# EAGLE design HV Board rev14 (EAGLE 9.6.2)
ENGINEER: Arvind Srinivasan

## Sheet 1 of 3: GLV Systems 1 (Main I/O, Power, Current Sensors, and Shutdown Circuit)
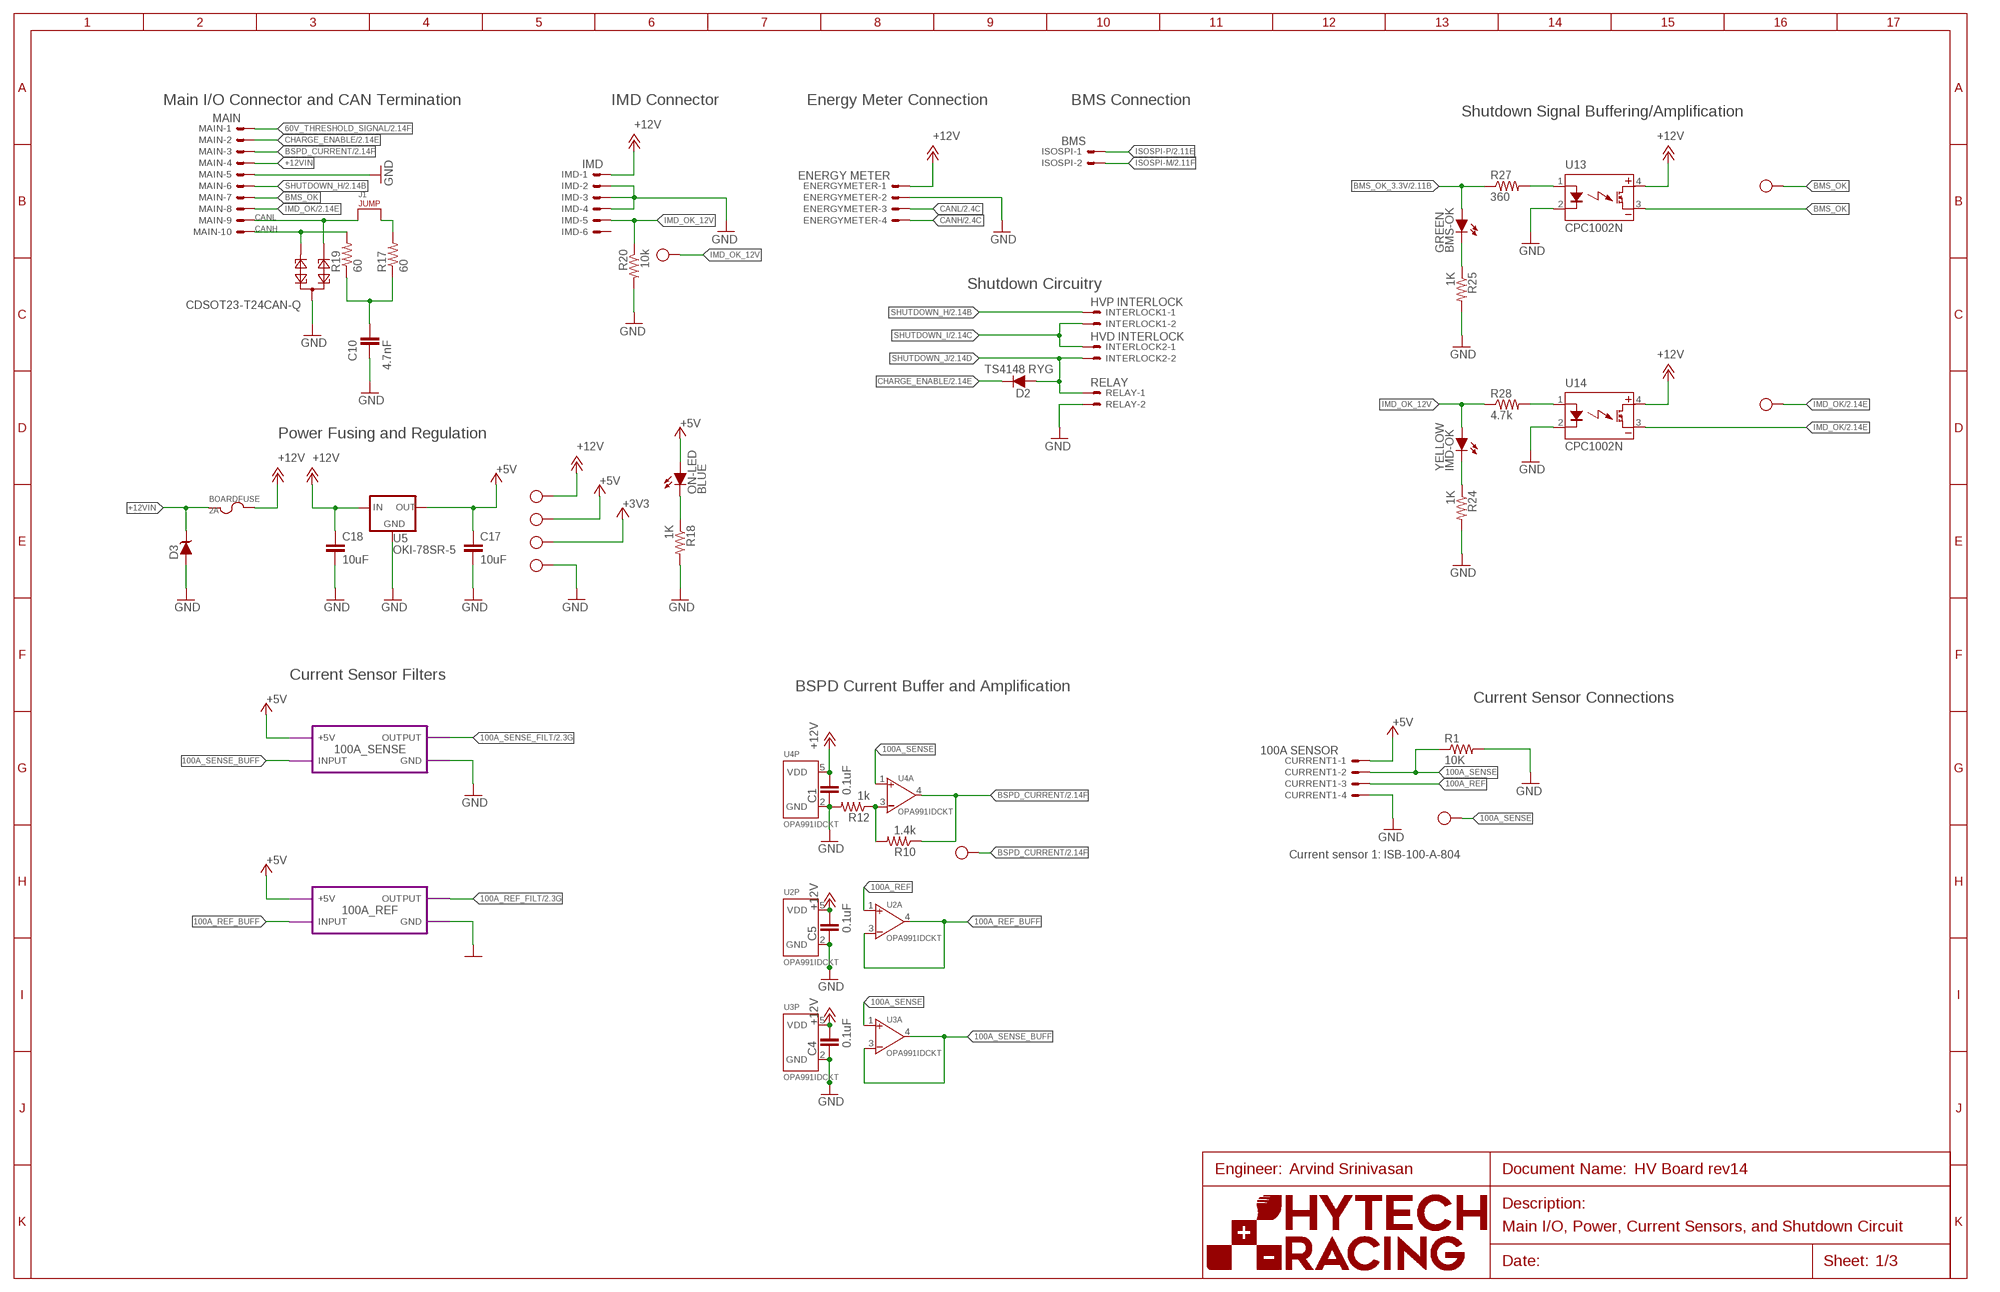
[diagram p0: schematic, sheet 1]
U$1 (FRAME_B): FRAME_DESCRIPTION: Main I/O, Power, Current Sensors, and Shutdown Circuit; ORIENTATION: LANDSCAPE; SIZE: B

### Parts
$$U$3  TEST_POINTMICRO_MINIATURE  [MICRO_MINIATURE]
$$U$12  TEST_POINTMICRO_MINIATURE  [MICRO_MINIATURE]
BMS-OK  GREEN  LED-0603  [LED-603]
BOARDFUSE  2A  FUSE_MINIBLADE  [MINI-BLADE_FUSE_HOLDER]
C1  0.1uF  CAP0603-CAP  [0603-CAP@1]
C4  0.1uF  CAP0603-CAP  [0603-CAP@1]
C5  0.1uF  CAP0603-CAP  [0603-CAP@1]
C10  4.7nF  CAP0603-CAP  [0603-CAP@1]
C17  10uF  CAP0603-CAP  [0603-CAP@1]
C18  10uF  CAP0603-CAP  [0603-CAP@1]
CURRENT1  100A SENSOR  CONNECTOR-4NANO-FIT-VERTICAL-4  [NANO-FIT_VERTICAL-4]
D2  TS4148 RYG  DIODE0805  [0805_D]
D3  TVS_15V  [SOT-23]
ENERGYMETER  ENERGY METER  CONNECTOR-4NANO-FIT-VERTICAL-4  [NANO-FIT_VERTICAL-4]
IMD  IMD  CONNECTOR-6NANO-FIT_VERTICAL-6  [NANO-FIT_VERTICAL-6]
IMD-OK  YELLOW  LED-0603  [LED-603]
INTERLOCK1  HVP INTERLOCK  CONNECTOR-2NANO-FIT_VERTICAL-2  [NANO-FIT_VERTICAL-2]
INTERLOCK2  HVD INTERLOCK  CONNECTOR-2NANO-FIT_VERTICAL-2  [NANO-FIT_VERTICAL-2]
ISOSPI  BMS  CONNECTOR-2NANO-FIT_VERTICAL-2  [NANO-FIT_VERTICAL-2]
J1  JUMPER.1  [1X02]
MAIN  MAIN  CONNECTOR-10NANO-FIT_VERTICAL-10  [NANO-FIT_VERTICAL-10]
ON-LED  BLUE  LED-0603  [LED-603]
R1  10K  RESISTOR0603  [0603-RES@1]
R10  1.4k  RESISTOR0603  [0603-RES@1]
R12  1k  RESISTOR0603  [0603-RES@1]
R17  60  RESISTOR0603  [0603-RES@1]
R18  1K  RESISTOR0603  [0603-RES@1]
R19  60  RESISTOR0603  [0603-RES@1]
R20  10k  RESISTOR0603  [0603-RES@1]
R24  1K  RESISTOR0603  [0603-RES@1]
R25  1K  RESISTOR0603  [0603-RES@1]
R27  360  RESISTOR0603  [0603-RES@1]
R28  4.7k  RESISTOR0603  [0603-RES@1]
RELAY  RELAY  CONNECTOR-2NANO-FIT_VERTICAL-2  [NANO-FIT_VERTICAL-2]
U2  OPAMP_1_CHANNEL_OPA991  [SC-70-5]
U3  OPAMP_1_CHANNEL_OPA991  [SC-70-5]
U4  OPAMP_1_CHANNEL_OPA991  [SC-70-5]
U5  OKI-78SR-5  [OKI-78SR@1]
U10  CDSOT23-T24CAN-Q  [SOT23]
U13  CPC1002N  [SOP04]
U14  CPC1002N  [SOP04]
U$3  TEST_POINTMICRO_MINIATURE  [MICRO_MINIATURE]
U$4  TEST_POINTMICRO_MINIATURE  [MICRO_MINIATURE]
U$5  TEST_POINTMICRO_MINIATURE  [MICRO_MINIATURE]
U$6  TEST_POINTMICRO_MINIATURE  [MICRO_MINIATURE]
U$7  TEST_POINTMICRO_MINIATURE  [MICRO_MINIATURE]
U$11  TEST_POINTMICRO_MINIATURE  [MICRO_MINIATURE]
U$13  TEST_POINTMICRO_MINIATURE  [MICRO_MINIATURE]

### Module instances
100A_SENSE = 1KHZ-FILTER
100A_REF = 1KHZ-FILTER

### Nets
60V_THRESHOLD_SIGNAL: MAIN.P$1 ; also sheet 2,3
100A_REF: CURRENT1.P$3 U2.1(A:VIN+)
100A_REF_BUFF: U2.3(A:VIN-) U2.4(A:VOUT) ; port 100A_REF.INPUT
100A_REF_FILT: port 100A_REF.OUTPUT ; also sheet 2
100A_SENSE: CURRENT1.P$2 R1.1 U3.1(A:VIN+) U4.1(A:VIN+) U$4.P$1
100A_SENSE_BUFF: U3.3(A:VIN-) U3.4(A:VOUT) ; port 100A_SENSE.INPUT
100A_SENSE_FILT: port 100A_SENSE.OUTPUT ; also sheet 2
+3V3: U$7.P$1 ; also sheet 2
+5V: $$U$3.P$1 C17.1 CURRENT1.P$1 ON-LED.A U5.3(OUT) ; port 100A_SENSE.+5V 100A_REF.+5V ; also sheet 2
+12V: BOARDFUSE.R1 BOARDFUSE.R2 C1.2 C4.2 C5.2 C18.1 ENERGYMETER.P$1 IMD.P$1 U2.5(P:VDD) U3.5(P:VDD) U4.5(P:VDD) U5.1(IN) U13.4(DC+) U14.4(DC+) U$5.P$1 ; also sheet 2,3
+12VIN: BOARDFUSE.L1 BOARDFUSE.L2 D3.3(C) MAIN.P$4
BMS_OK: MAIN.P$7 U13.3(DC-) U$13.P$1
BMS_OK_3.3V: BMS-OK.A R27.1 ; also sheet 2
BSPD_CURRENT: MAIN.P$3 R10.1 U4.4(A:VOUT) U$6.P$1 ; also sheet 2
CANH: ENERGYMETER.P$4 MAIN.P$10 R19.2 U10.2 ; also sheet 2
CANL: ENERGYMETER.P$3 J1.1 MAIN.P$9 U10.1 ; also sheet 2
CHARGE_ENABLE: D2.C MAIN.P$2 ; also sheet 2
GND: C1.1 C4.1 C5.1 C10.1 C17.2 C18.2 CURRENT1.P$4 D3.1(A) ENERGYMETER.P$2 IMD.P$2 IMD.P$3 IMD.P$4 MAIN.P$5 R1.2 R12.2 R18.2 R20.2 R24.2 R25.2 RELAY.P$2 U2.2(P:GND) U3.2(P:GND) U4.2(P:GND) U5.2(GND) U10.3 U13.2(CONTROL-) U14.2(CONTROL-) U$3.P$1 ; port 100A_SENSE.GND 100A_REF.GND ; also sheet 2,3
IMD_OK: $$U$12.P$1 MAIN.P$8 U14.3(DC-) ; also sheet 2
IMD_OK_12V: IMD-OK.A IMD.P$5 R20.1 R28.1 U$11.P$1
ISOSPI-M [ISO_SPI]: ISOSPI.P$2 ; also sheet 2
ISOSPI-P [ISO_SPI]: ISOSPI.P$1 ; also sheet 2
N$3: ON-LED.C R18.1
N$8: R28.2 U14.1(CONTROL+)
N$9: IMD-OK.C R24.1
N$11: C10.2 R17.1 R19.1
N$15: R10.2 R12.1 U4.3(A:VIN-)
N$16: R27.2 U13.1(CONTROL+)
N$17: BMS-OK.C R25.1
N$23: J1.2 R17.2
SHUTDOWN_H: INTERLOCK1.P$1 MAIN.P$6 ; also sheet 2
SHUTDOWN_I: INTERLOCK1.P$2 INTERLOCK2.P$1 ; also sheet 2
SHUTDOWN_J: D2.A INTERLOCK2.P$2 RELAY.P$1 ; also sheet 2,3
Unconnected: IMD.P$6

### Notes on the sheet
- Main I/O Connector and CAN Termination | IMD Connector | Energy Meter Connection | BMS Connection
- Shutdown Signal Buffering/Amplification
- Shutdown Circuitry
- Power Fusing and Regulation
- Current Sensor Filters
- BSPD Current Buffer and Amplification
- Current Sensor Connections
- Current sensor 1: ISB-100-A-804

## Sheet 2 of 3: GLV Systems 2 (Microcontroller, Watchdog, BMS, CAN, and ADC)
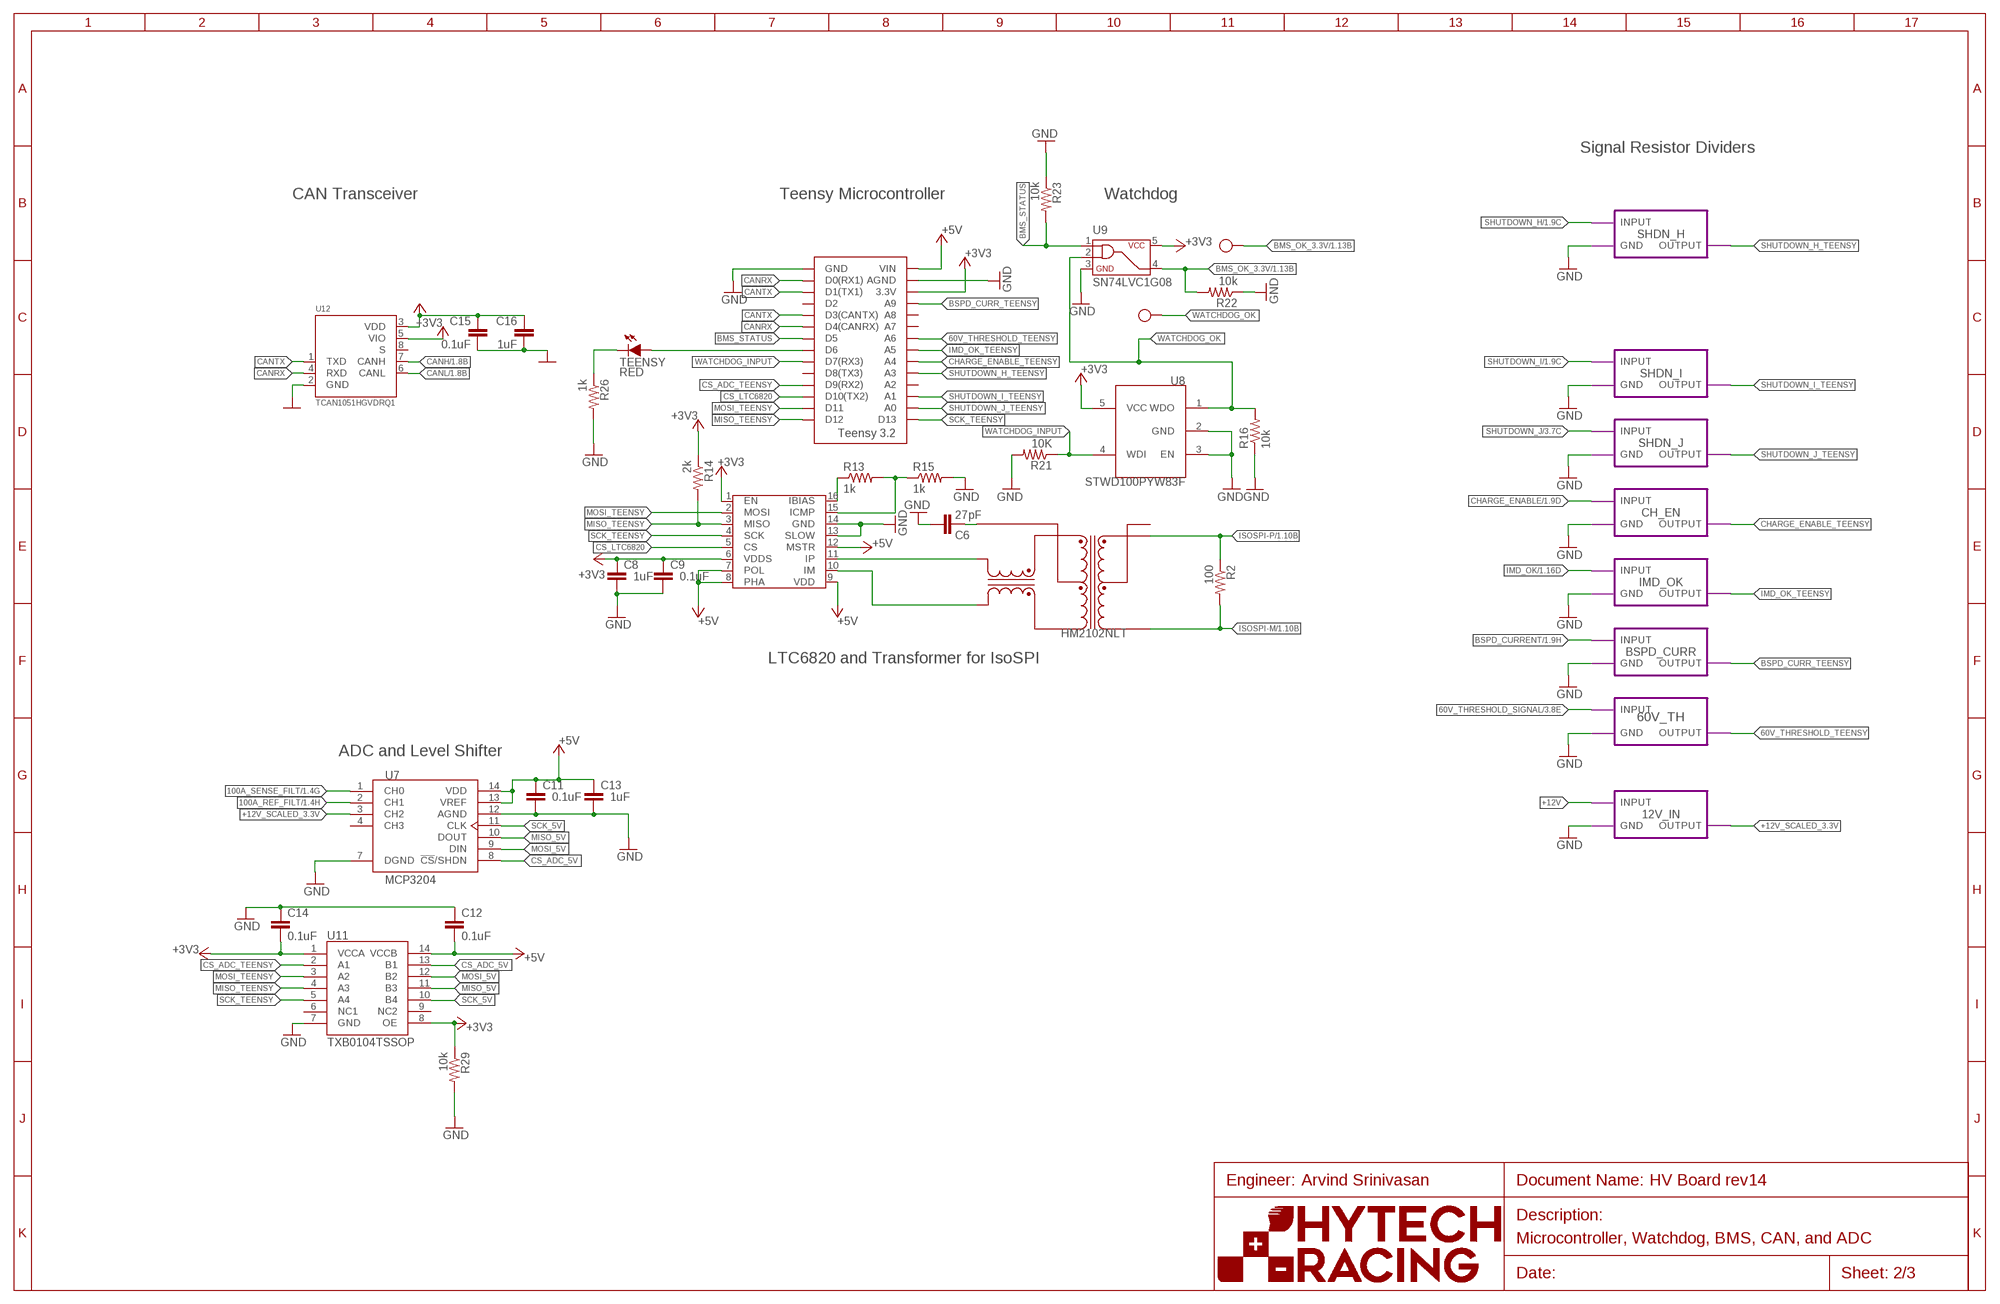
[diagram p1: schematic, sheet 2]
U$12 (FRAME_B): FRAME_DESCRIPTION: Microcontroller, Watchdog, BMS, CAN, and ADC; ORIENTATION: LANDSCAPE; SIZE: B

### Parts
C6  27pF  CAP0603-CAP  [0603-CAP@1]
C8  1uF  CAP0603-CAP  [0603-CAP@1]
C9  0.1uF  CAP0603-CAP  [0603-CAP@1]
C11  0.1uF  CAP0603-CAP  [0603-CAP@1]
C12  0.1uF  CAP0603-CAP  [0603-CAP@1]
C13  1uF  CAP0603-CAP  [0603-CAP@1]
C14  0.1uF  CAP0603-CAP  [0603-CAP@1]
C15  0.1uF  CAP0603-CAP  [0603-CAP@1]
C16  1uF  CAP0603-CAP  [0603-CAP@1]
R2  100  RESISTOR0603  [0603-RES@1]
R13  1k  RESISTOR0603  [0603-RES@1]
R14  2k  RESISTOR0603  [0603-RES@1]
R15  1k  RESISTOR0603  [0603-RES@1]
R16  10k  RESISTOR0603  [0603-RES@1]
R21  10K  RESISTOR0603  [0603-RES@1]
R22  10k  RESISTOR0603  [0603-RES@1]
R23  10k  RESISTOR0603  [0603-RES@1]
R26  1k  RESISTOR0603  [0603-RES@1]
R29  10k  RESISTOR0603  [0603-RES@1]
TEENSY  RED  LED-0603  [LED-603]
TEENSY3.1  TEENSY_3.2_SIMPLE  [TEENSY_3.2_SIMPLE]
U1  HM2102NLT  [HM2102NLT]
U6  LTC6820  [MSOP-16]
U7  MCP3204  [SO14]
U8  STWD100PYW83F  [SOT323-5]
U9  SN74LVC1G08  SN74LVC1G08SOT-323-5  [SOT323-5]
U11  TXB0104TSSOP  [TSSOP-14]
U12  CAN_TRANSCIEVER_TCAN1051HQV-Q1  [SOIC-08]
U$9  TEST_POINTMICRO_MINIATURE  [MICRO_MINIATURE]
U$10  TEST_POINTMICRO_MINIATURE  [MICRO_MINIATURE]

### Module instances
SHDN_J = 43/12-RESISTOR-DIVIDER
SHDN_H = 43/12-RESISTOR-DIVIDER
IMD_OK = 43/12-RESISTOR-DIVIDER
BSPD_CURR = 43/12-RESISTOR-DIVIDER
CH_EN = 43/12-RESISTOR-DIVIDER
SHDN_I = 43/12-RESISTOR-DIVIDER
12V_IN = 43/12-RESISTOR-DIVIDER
60V_TH = 43/12-RESISTOR-DIVIDER

### Nets
60V_THRESHOLD_SIGNAL: port 60V_TH.INPUT ; also sheet 1,3
60V_THRESHOLD_TEENSY: TEENSY3.1.A6 ; port 60V_TH.OUTPUT
100A_REF_FILT: U7.2(CH1) ; also sheet 1
100A_SENSE_FILT: U7.1(CH0) ; also sheet 1
+3V3: C8.1 C9.1 C14.1 R14.1 R29.1 TEENSY3.1.3.3V U6.1(EN) U6.6(VDDS) U8.5(VCC) U9.5 U11.1(VCCA) U11.8(OE) U12.5(VIO) ; also sheet 1
+5V: C11.1 C12.1 C13.1 C15.2 C16.2 TEENSY3.1.VIN U6.7(POL) U6.8(PHA) U6.9(VDD) U6.12(MSTR) U7.13(VREF) U7.14(VDD) U11.14(VCCB) U12.3(VDD) ; also sheet 1
+12V: port 12V_IN.INPUT ; also sheet 1,3
+12V_SCALED_3.3V: U7.3(CH2) ; port 12V_IN.OUTPUT
BMS_OK_3.3V: R22.2 U9.4 U$10.P$1 ; also sheet 1
BMS_STATUS: R23.2 TEENSY3.1.D5 U9.1
BSPD_CURR_TEENSY: TEENSY3.1.A9 ; port BSPD_CURR.OUTPUT
BSPD_CURRENT: port BSPD_CURR.INPUT ; also sheet 1
CANH: U12.7(CANH) ; also sheet 1
CANL: U12.6(CANL) ; also sheet 1
CANRX: TEENSY3.1.D0(RX1) TEENSY3.1.D4(CANRX) U12.4(RXD)
CANTX: TEENSY3.1.D1(TX1) TEENSY3.1.D3(CANTX) U12.1(TXD)
CHARGE_ENABLE: port CH_EN.INPUT ; also sheet 1
CHARGE_ENABLE_TEENSY: TEENSY3.1.A4 ; port CH_EN.OUTPUT
CS_ADC_5V: U7.8(!CS!/SHDN) U11.13(B1)
CS_ADC_TEENSY: TEENSY3.1.D9(RX2) U11.2(A1)
CS_LTC6820: TEENSY3.1.D10(TX2) U6.5(CS)
GND: C6.2 C8.2 C9.2 C11.2 C12.2 C13.2 C14.2 C15.1 C16.1 R15.2 R16.1 R21.2 R22.1 R23.1 R26.2 R29.2 TEENSY3.1.AGND TEENSY3.1.GND U6.13(SLOW) U6.14(GND) U7.7(DGND) U7.12(AGND) U8.2(GND) U8.3(EN) U9.3 U11.7(GND) U12.2(GND) ; port SHDN_H.GND SHDN_J.GND CH_EN.GND IMD_OK.GND BSPD_CURR.GND 60V_TH.GND SHDN_I.GND 12V_IN.GND ; also sheet 1,3
IM: U1.P$10(TD-) U6.10(IM)
IMD_OK: port IMD_OK.INPUT ; also sheet 1
IMD_OK_TEENSY: TEENSY3.1.A5 ; port IMD_OK.OUTPUT
IP: U1.P$12(TD+) U6.11(IP)
ISOSPI-M [ISO_SPI]: R2.2 U1.P$3(MX-) ; also sheet 1
ISOSPI-P [ISO_SPI]: R2.1 U1.P$1(MX+) ; also sheet 1
MISO_5V: U7.10(DOUT) U11.11(B3)
MISO_TEENSY: R14.2 TEENSY3.1.D12 U6.3(MISO) U11.4(A3)
MOSI_5V: U7.9(DIN) U11.12(B2)
MOSI_TEENSY: TEENSY3.1.D11 U6.2(MOSI) U11.3(A2)
N$29: R26.1 TEENSY.C
N$31: R13.1 U6.16(IBIAS)
N$32: R13.2 R15.1 U6.15(ICMP)
N$35: C6.1 U1.P$11(TCT)
SCK_5V: U7.11(CLK) U11.10(B4)
SCK_TEENSY: TEENSY3.1.D13 U6.4(SCK) U11.5(A4)
SHUTDOWN_H: port SHDN_H.INPUT ; also sheet 1
SHUTDOWN_H_TEENSY: TEENSY3.1.A3 ; port SHDN_H.OUTPUT
SHUTDOWN_I: port SHDN_I.INPUT ; also sheet 1
SHUTDOWN_I_TEENSY: TEENSY3.1.A1 ; port SHDN_I.OUTPUT
SHUTDOWN_J: port SHDN_J.INPUT ; also sheet 1,3
SHUTDOWN_J_TEENSY: TEENSY3.1.A0 ; port SHDN_J.OUTPUT
TEENSY_STATUS: TEENSY3.1.D6 TEENSY.A
WATCHDOG_INPUT: R21.1 TEENSY3.1.D7(RX3) U8.4(WDI)
WATCHDOG_OK: R16.2 U8.1(WDO) U9.2 U$9.P$1
Unconnected: TEENSY3.1.A2 TEENSY3.1.A7 TEENSY3.1.A8 TEENSY3.1.D2 TEENSY3.1.D8(TX3) U1.P$2(MCT) U1.P$4(MX+) U1.P$5(MCT) U1.P$6(MX-) U1.P$7(TD-) U1.P$8(TCT) U1.P$9(TD+) U7.4(CH3) U11.6(NC1) U11.9(NC2) U12.8(S)

### Notes on the sheet
- Signal Resistor Dividers
- CAN Transceiver | Teensy Microcontroller | Watchdog
- LTC6820 and Transformer for IsoSPI
- ADC and Level Shifter

## Sheet 3 of 3: HV Systems (Discharge, Precharge, and TSAL Signal/Voltage Indicator)
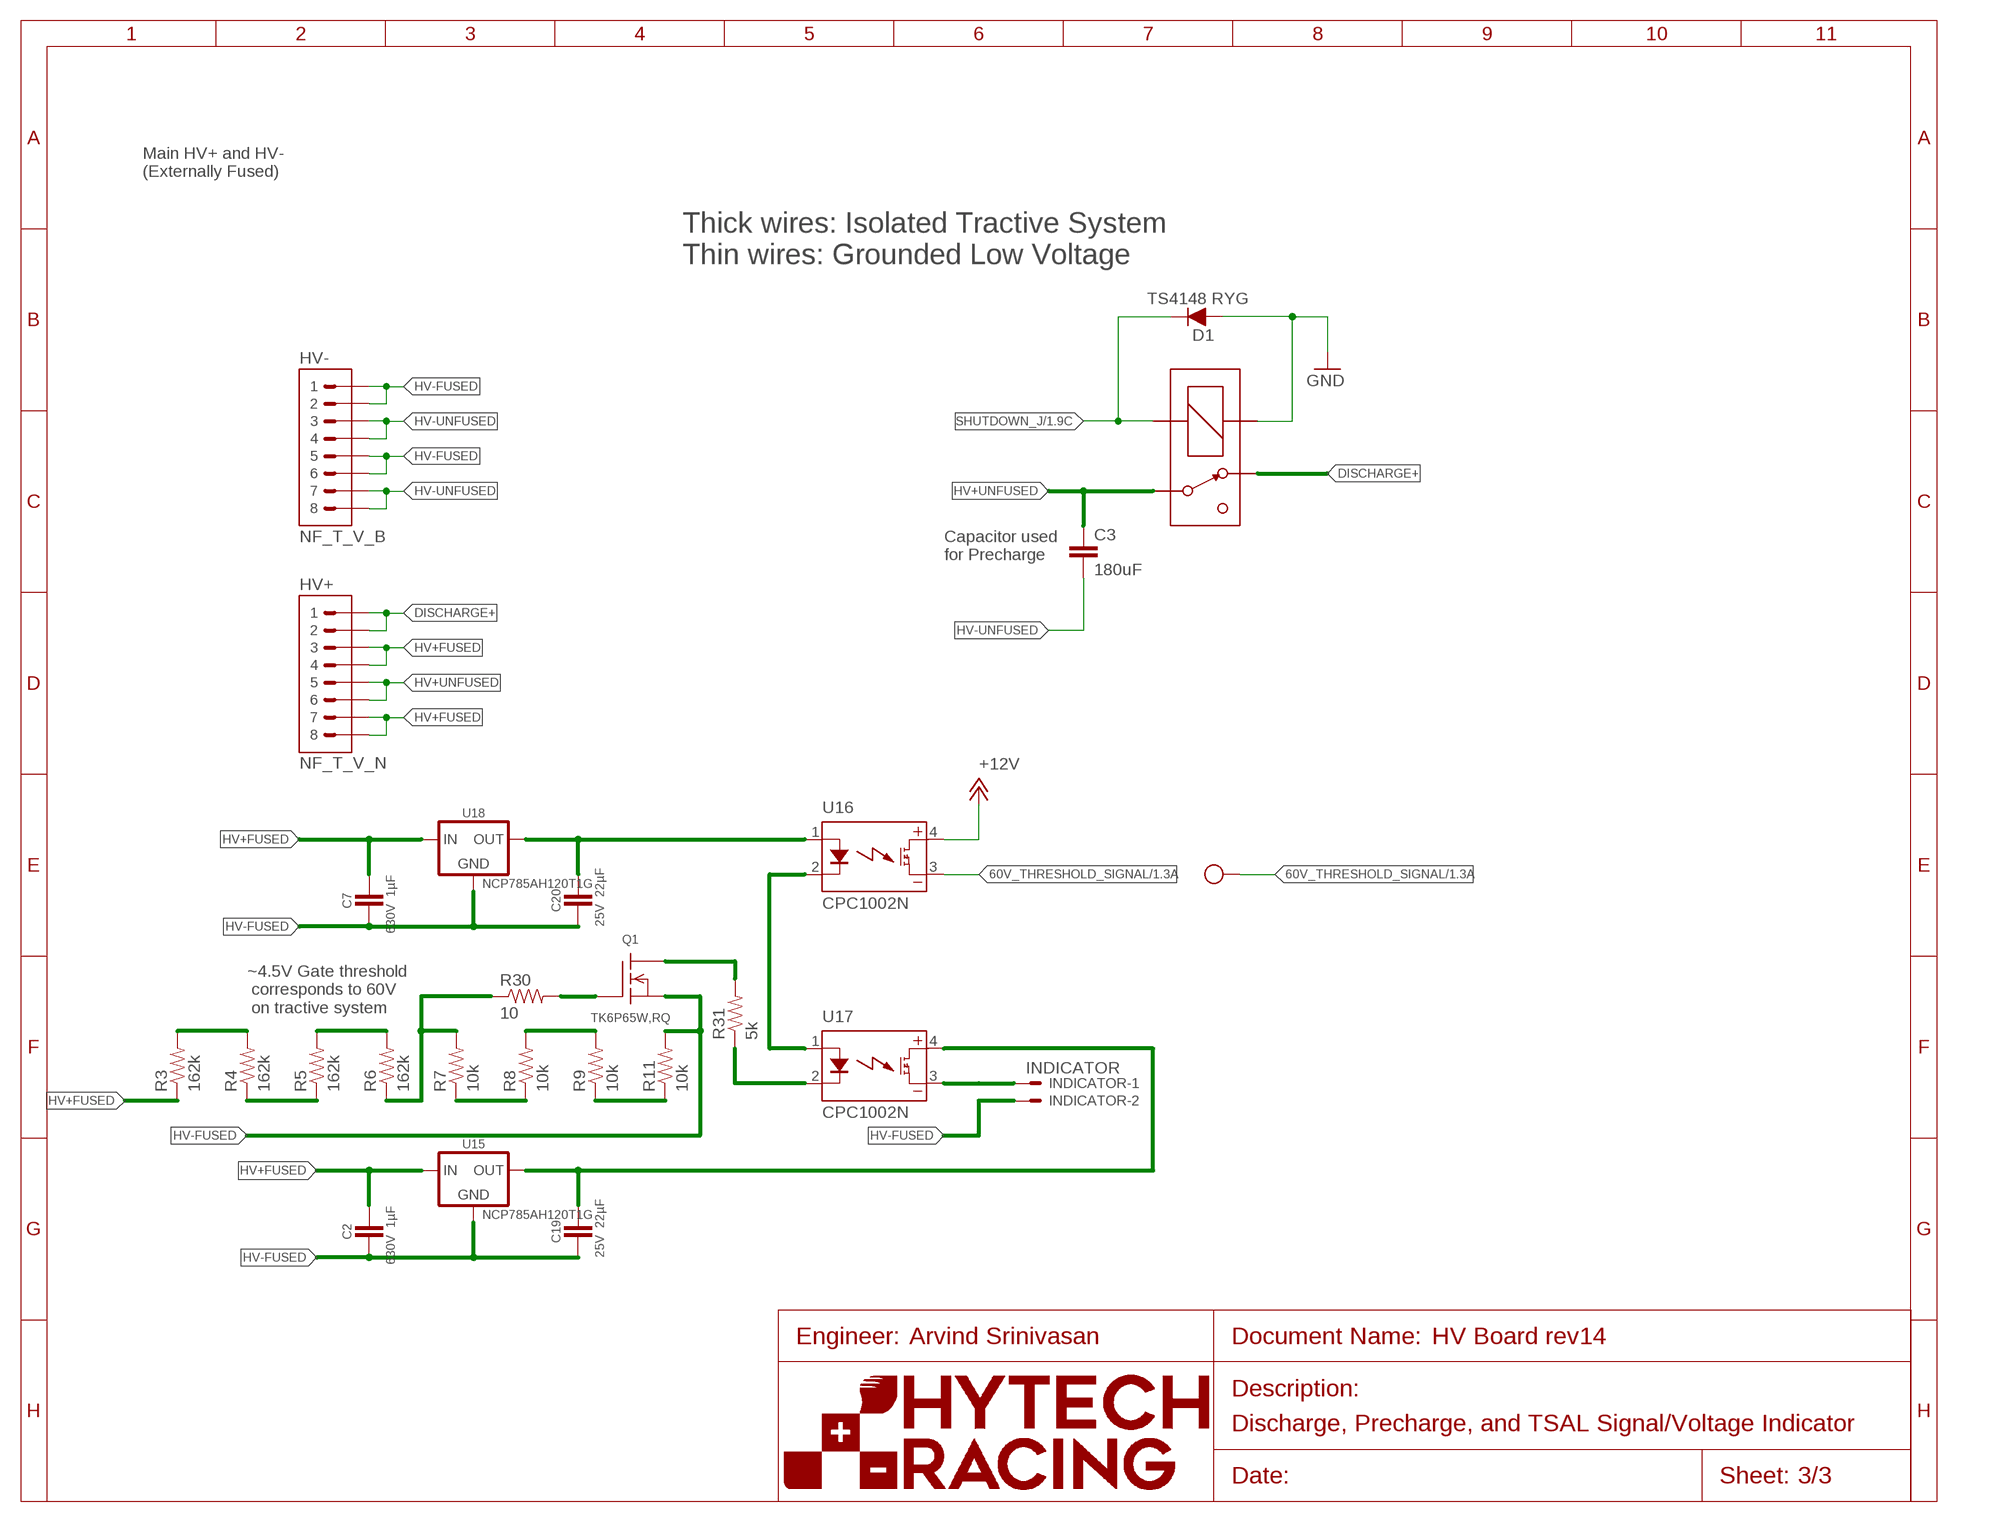
[diagram p2: schematic, sheet 3]
U$2 (FRAME_A): FRAME_DESCRIPTION: Discharge, Precharge, and TSAL Signal/Voltage Indicator; ORIENTATION: LANDSCAPE; SIZE: A

### Parts
$$$$U$3  DBT71210  [DBT71210]
C2  CAPACITOR_2220_630V_1UF  [2220-CAP]
C3  180uF  CAP  [LLS2V181MELA]
C7  CAPACITOR_2220_630V_1UF  [2220-CAP]
C19  CAPACITOR_0805_25V_22UF  [0805-CAP]
C20  CAPACITOR_0805_25V_22UF  [0805-CAP]
D1  TS4148 RYG  DIODE0805  [0805_D]
HV+  CONNECTOR-8_NF_T_V_NATURAL  [MOLEX_NANOFIT_PTH_08]
HV-  CONNECTOR-8_NF_T_V_BLACK  [MOLEX_NANOFIT_PTH_08]
INDICATOR  INDICATOR  CONNECTOR-2NANO-FIT_VERTICAL-2  [NANO-FIT_VERTICAL-2]
Q1  TRANSISTOR_N_MOS_2-7K1S_TK6P65W  [DPAK(2-7K1S)]
R3  162k  RESISTOR0603  [0603-RES@1]
R4  162k  RESISTOR0603  [0603-RES@1]
R5  162k  RESISTOR0603  [0603-RES@1]
R6  162k  RESISTOR0603  [0603-RES@1]
R7  10k  RESISTOR0603  [0603-RES@1]
R8  10k  RESISTOR0603  [0603-RES@1]
R9  10k  RESISTOR0603  [0603-RES@1]
R11  10k  RESISTOR0603  [0603-RES@1]
R30  10  RESISTOR0603  [0603-RES@1]
R31  5k  RESISTOR0603  [0603-RES@1]
U15  VOLTAGE_REGULATOR_SOT89_12V  [SOT89]
U16  CPC1002N  [SOP04]
U17  CPC1002N  [SOP04]
U18  VOLTAGE_REGULATOR_SOT89_12V  [SOT89]
U$8  TEST_POINTMICRO_MINIATURE  [MICRO_MINIATURE]

### Nets
60V_THRESHOLD_SIGNAL: U16.3(DC-) U$8.P$1 ; also sheet 1,2
+12V: U16.4(DC+) ; also sheet 1,2
DISCHARGE+ [TS]: $$$$U$3.CONTACT2(O) HV+.1 HV+.2
GND: $$$$U$3.COIL+ D1.A ; also sheet 1,2
HV+FUSED [TS]: C2.1 C7.1 HV+.3 HV+.4 HV+.7 HV+.8 R3.1 U15.1(IN) U18.1(IN)
HV+UNFUSED [TS]: $$$$U$3.CONTACT1(P) C3.P$1 HV+.5 HV+.6
HV-FUSED [TS]: C2.2 C7.2 C19.2 C20.2 HV-.1 HV-.2 HV-.5 HV-.6 INDICATOR.P$2 Q1.3(S) R11.2 U15.2(GND) U15.2@2(GND) U18.2(GND) U18.2@2(GND)
HV-UNFUSED: C3.P$2 HV-.3 HV-.4 HV-.7 HV-.8
N$4: Q1.1(G) R30.2
N$5 [TS]: C19.1 U15.3(OUT) U17.4(DC+)
N$7 [TS]: R9.1 R11.1
N$10 [TS]: R8.2 R9.2
N$12 [TS]: R7.1 R8.1
N$18 [TS]: C20.1 U16.1(CONTROL+) U18.3(OUT)
N$19 [TS]: R6.1 R7.2 R30.1
N$20 [TS]: R5.2 R6.2
N$21 [TS]: R4.1 R5.1
N$22 [TS]: R3.2 R4.2
N$30 [TS]: R31.1 U17.2(CONTROL-)
N$33 [TS]: U16.2(CONTROL-) U17.1(CONTROL+)
N$34 [TS]: INDICATOR.P$1 U17.3(DC-)
N$58 [TS]: Q1.2(D) R31.2
SHUTDOWN_J: $$$$U$3.COIL- D1.C ; also sheet 1,2

### Notes on the sheet
- Main HV+ and HV-
  (Externally Fused)
- Thick wires: Isolated Tractive System
  Thin wires: Grounded Low Voltage
- Capacitor used
  for Precharge
- ~4.5V Gate threshold
   corresponds to 60V
   on tractive system

## Library data of the parts
$$$$U$3 = HyTechDevices:DBT71210: DBT71210 Reed Relay Form B (Standard normally closed), switch 12V
$$U$3 $$U$12 U$3-U$11 U$13 = HyTechDevices:TEST_POINT: Keystone Electronics Test Point 5005
BMS-OK IMD-OK ON-LED TEENSY = HyTechDevices:LED: Light Emitting Diode (LED) Source: Dangerous Prototypes Eagle Library <https://github.com/DangerousPrototypes/Eagle_Part_Library>
BOARDFUSE = HyTechDevices:FUSE: Fuse/Fuseclips Keystone Electronics 3568 Fuse Mouser Part <http://www.mouser.com/ProductDetail/Keystone-Electronics/3568> Datasheet <http://www.mouser.com/ds/2/215/568-742601.pdf> Bussman/Eaton Midget Fuse Clip 1A3400 <http://www.mouser.com/ProductDetail/Bussmann-Eaton/BK-1A3400-09-R/?qs=sGAEpiMZZMuG%252bgnN5hGYGzzlAelq2OxnKqVSMVjq8I4%3d> Schurter 0751.0110 Brass Fuse Clip Datasheet <http://www.mouser.com/ds/2/358/typ_OG__Clip__5x20-2553.pdf> Bel Fuse 0ZCF Series Surface Mount PTC (resettable) Fuse Datasheet <https://belfuse.com/resources/CircuitProtection/datasheets/0ZCF%20Nov2016.pdf> Littelfuse 1812L Series Surface Mount PTC (resettable) Fuse Datasheet <https://m.littelfuse.com/~/media/electronics/datasheets/resettable_ptcs/littelfuse_ptc_1812l_datasheet.pdf.pdf>; RATING: 3A
C1 C4 C5 C10 = HyTechDevices:CAP: Capacitor Standard 0603 ceramic capacitor, and 0.1" leaded capacitor.; TOLERANCE: 5%; VOLTAGE: 50V
C2 C7 = HyTechDevices:CAPACITOR_?_*: Capacitor, Non-Polarized VJ...1BC Series Datasheet <https://www.mouser.com/datasheet/2/427/vjw1bcbascomseries-1762447.pdf> Samsung Datasheet <https://www.mouser.com/datasheet/2/585/MLCC-1837944.pdf> Walsin Datasheet <https://www.mouser.com/datasheet/2/210/WTC_MLCC_General_Purpose-1534899.pdf> GRM188R61A226ME15D <https://www.mouser.com/datasheet/2/281/1/GRM188R61A226ME15_02A-1985787.pdf> GRM188R61E106MA73D <https://www.mouser.com/datasheet/2/281/1/GRM188R61E106MA73_01A-1985806.pdf> 885012006013 <https://www.mouser.com/datasheet/2/445/885012006013-1726946.pdf> 2220Y6300105KXTWS2 <https://www.mouser.com/datasheet/2/218/SMD_High_and_Std_StackiCap_P62-1825512.pdf> Yageo Class 2, X5R <https://www.mouser.com/datasheet/2/447/UPY_GPHC_X5R_4V_to_50V_26-1827097.pdf>; CAPACITANCE: 1µF; DKPN: 1608-2220Y6300105KXTWS2CT-ND; MANUFACTURER: Knowles Syfer; MOPN: 843-2220Y63105KXTWS2; MPN: 2220Y6300105KXTWS2; TOLERANCE: 10%; VOLTAGE: 630V
C3 = HyTechDevices:CAP: Capacitor Standard 0603 ceramic capacitor, and 0.1" leaded capacitor.
C6 C8 C9 C11-C16 = HyTechDevices:CAP: Capacitor Standard 0603 ceramic capacitor, and 0.1" leaded capacitor.; TOLERANCE: 5%; VOLTAGE: 10V
C17 C18 = HyTechDevices:CAP: Capacitor Standard 0603 ceramic capacitor, and 0.1" leaded capacitor.; TOLERANCE: 5%; VOLTAGE: 25V
C19 C20 = HyTechDevices:CAPACITOR_?_*: Capacitor, Non-Polarized VJ...1BC Series Datasheet <https://www.mouser.com/datasheet/2/427/vjw1bcbascomseries-1762447.pdf> Samsung Datasheet <https://www.mouser.com/datasheet/2/585/MLCC-1837944.pdf> Walsin Datasheet <https://www.mouser.com/datasheet/2/210/WTC_MLCC_General_Purpose-1534899.pdf> GRM188R61A226ME15D <https://www.mouser.com/datasheet/2/281/1/GRM188R61A226ME15_02A-1985787.pdf> GRM188R61E106MA73D <https://www.mouser.com/datasheet/2/281/1/GRM188R61E106MA73_01A-1985806.pdf> 885012006013 <https://www.mouser.com/datasheet/2/445/885012006013-1726946.pdf> 2220Y6300105KXTWS2 <https://www.mouser.com/datasheet/2/218/SMD_High_and_Std_StackiCap_P62-1825512.pdf> Yageo Class 2, X5R <https://www.mouser.com/datasheet/2/447/UPY_GPHC_X5R_4V_to_50V_26-1827097.pdf>; CAPACITANCE: 22µF; DKPN: 311-1903-1-ND; MANUFACTURER: Yageo; MOPN: 603-CC805MKX5R8BB226; MPN: CC0805MKX5R8BB226; TOLERANCE: 20%; VOLTAGE: 25V
CURRENT1 ENERGYMETER = HyTechDevices:CONNECTOR-4: Mini-Fit Junior connector 4 pole Source: http://www.molex.com
D1 D2 = HyTechDevices:DIODE: DIODE general purpose rectifier
D3 = HyTechDevices:TVS_*: TVS Diode GSOT Datasheet <https://www.mouser.com/datasheet/2/427/gsot03-1767593.pdf>; DKPN: GSOT15-E3-08CT-ND; MANUFACTURER: Vishay General Semiconductor - Diodes Division; MOPN: 78-GSOT15-E3-08; MPN: GSOT15-E3-08; VOLTAGE: 15V
HV+ = HyTechDevices:CONNECTOR-8_?_*: 8 Pin Connector; MANUFACTURER: Molex; MODEL: NF_T_V_N; MPN: 105310-2308
HV- = HyTechDevices:CONNECTOR-8_?_*: 8 Pin Connector; MANUFACTURER: Molex; MODEL: NF_T_V_B; MPN: 105310-1308
IMD = HyTechDevices:CONNECTOR-6: Mini-Fit Junior connector 6 pole Source: http://www.molex.com
INDICATOR INTERLOCK1 INTERLOCK2 ISOSPI RELAY = HyTechDevices:CONNECTOR-2: Mini-Fit Junior connector 2 pole Source: http://www.molex.com
J1 = HyTechDevices:JUMPER: Jumper for changing operation of a device
MAIN = HyTechDevices:CONNECTOR-10: Mini-Fit Junior connector 10 pole Source: http://www.molex.com
Q1 = HyTechDevices:TRANSISTOR_N_MOS_?_*: N-MOSFET PMV15ENEA Datasheet <https://www.mouser.com/datasheet/2/916/PMV15ENEA-1604828.pdf> TK6P65W Datasheet <https://www.mouser.com/datasheet/2/408/TK6P65W_datasheet_en_20151225-1916290.pdf>; DKPN: TK6P65WRQCT-ND; MANUFACTURER: Toshiba Semiconductor and Storage; MOPN: 757-TK6P65WRQ; MPN: TK6P65W,RQ
R1 R10 R12-R15 R17-R21 R24-R29 = HyTechDevices:RESISTOR: Resistor Basic schematic elements and footprints for 0603, 1206, and PTH resistors.; TOLERANCE: 1%
R2 = HyTechDevices:RESISTOR: Resistor Basic schematic elements and footprints for 0603, 1206, and PTH resistors.; TOLERANCE: 1%; TYPE: TERMINATION
R3-R9 R11 R16 R22 R23 R30 R31 = HyTechDevices:RESISTOR: Resistor Basic schematic elements and footprints for 0603, 1206, and PTH resistors.
TEENSY3.1 = HyTechDevices:TEENSY_3.2_SIMPLE: Simple version of the Teensy 3.2 board that only uses the 2 main rows of pins, not the inner pins or the pins opposite the usb port.
U1 = HyTechDevices:HM2102NLT: 2 Channel SMT Transformer Turns ratio: 1CT: 1CT Isolation Voltage: 4300 VDC Inductance: 150 uH Leakage Inductance: 0.50 uH max DataSheet <https://www.mouser.com/datasheet/2/336/HM2102NL-1218600.pdf>
U2-U4 = HyTechDevices:OPAMP_1_CHANNEL_*: Op-Amp 1 Channel OPA991 Datasheet <https://www.ti.com/lit/ds/symlink/opa991.pdf?ts=1615503614502> Note: OPA991 is also a comparator; MPN: OPA991IDCKT
U5 = HyTechDevices:OKI-78SR-5: Murata OKI-78SR 5V 1.5A Non-Isolated Switching Regulator DC/DC - Datasheet <https://power.murata.com/data/power/oki-78sr.pdf>
U6 = HyTechDevices:LTC6820: Linear Technology isoSPI Isolated Communications Interface Datasheet <http://cds.linear.com/docs/en/datasheet/6820fb.pdf>
U7 = HyTechDevices:MCP3204
U8 = HyTechDevices:STWD100PYW83F: STWD100 Watchdog Timer (push-pull configuration) Datasheet <https://www.st.com/resource/en/datasheet/stwd100.pdf>
U9 = HyTechDevices:SN74LVC1G08: TI SN74LVC1G08 SINGLE 2-INPUT POSITIVE-AND GATE Datasheet <https://www.ti.com/lit/ds/symlink/sn74lvc1g08.pdf>
U10 = HyTechDevices:CDSOT23-T24CAN-Q: CAN Bus dual TVS array for transceiver ESD and surge protection
U11 = HyTechDevices:TXB0104: Texas Instruments TXB0104 4-channel low voltage to high voltage Logic Level Shifter. Minimum input voltage level 1.8V. Maximum output voltage level 5.5V.
U12 = HyTechDevices:CAN_TRANSCIEVER_TCAN1051*V-Q1: TCAN1051*V Can Tranciever Datasheet <https://www.ti.com/lit/ds/symlink/tcan1051hgv-q1.pdf?HQS=dis-mous-null-mousermode-dsf-pf-null-wwe&ts=1610765132518&ref_url=https%253A%252F%252Fwww.mouser.com%252Ff>; DKPN: 296-49935-1-ND; MANUFACTURER: Texas Instruments; MOPN: 595-TCAN1051HGVDQ1; MPN: TCAN1051HGVDRQ1
U13 U14 U16 U17 = HyTechDevices:CPC1002N: IXYS Solid State Relay .7A
U15 U18 = HyTechDevices:VOLTAGE_REGULATOR_?_*: Voltage Regulators LDL1117S50R Datasheet <https://www.mouser.com/datasheet/2/389/dm00366442-1799212.pdf> OKI-78SR Datasheet <https://www.mouser.com/datasheet/2/281/oki-78sr-56393.pdf> NCP785AH120T1G <https://www.mouser.com/datasheet/2/308/NCP785A_D-1812704.pdf>; DKPN: NCP785AH120T1GOSCT-ND; MANUFACTURER: ON Semiconductor; MOPN: 863-NCP785AH120T1G; MPN: NCP785AH120T1G

## Module 43/12-RESISTOR-DIVIDER
Ports: INPUT(in) GND(pwr) OUTPUT(out)
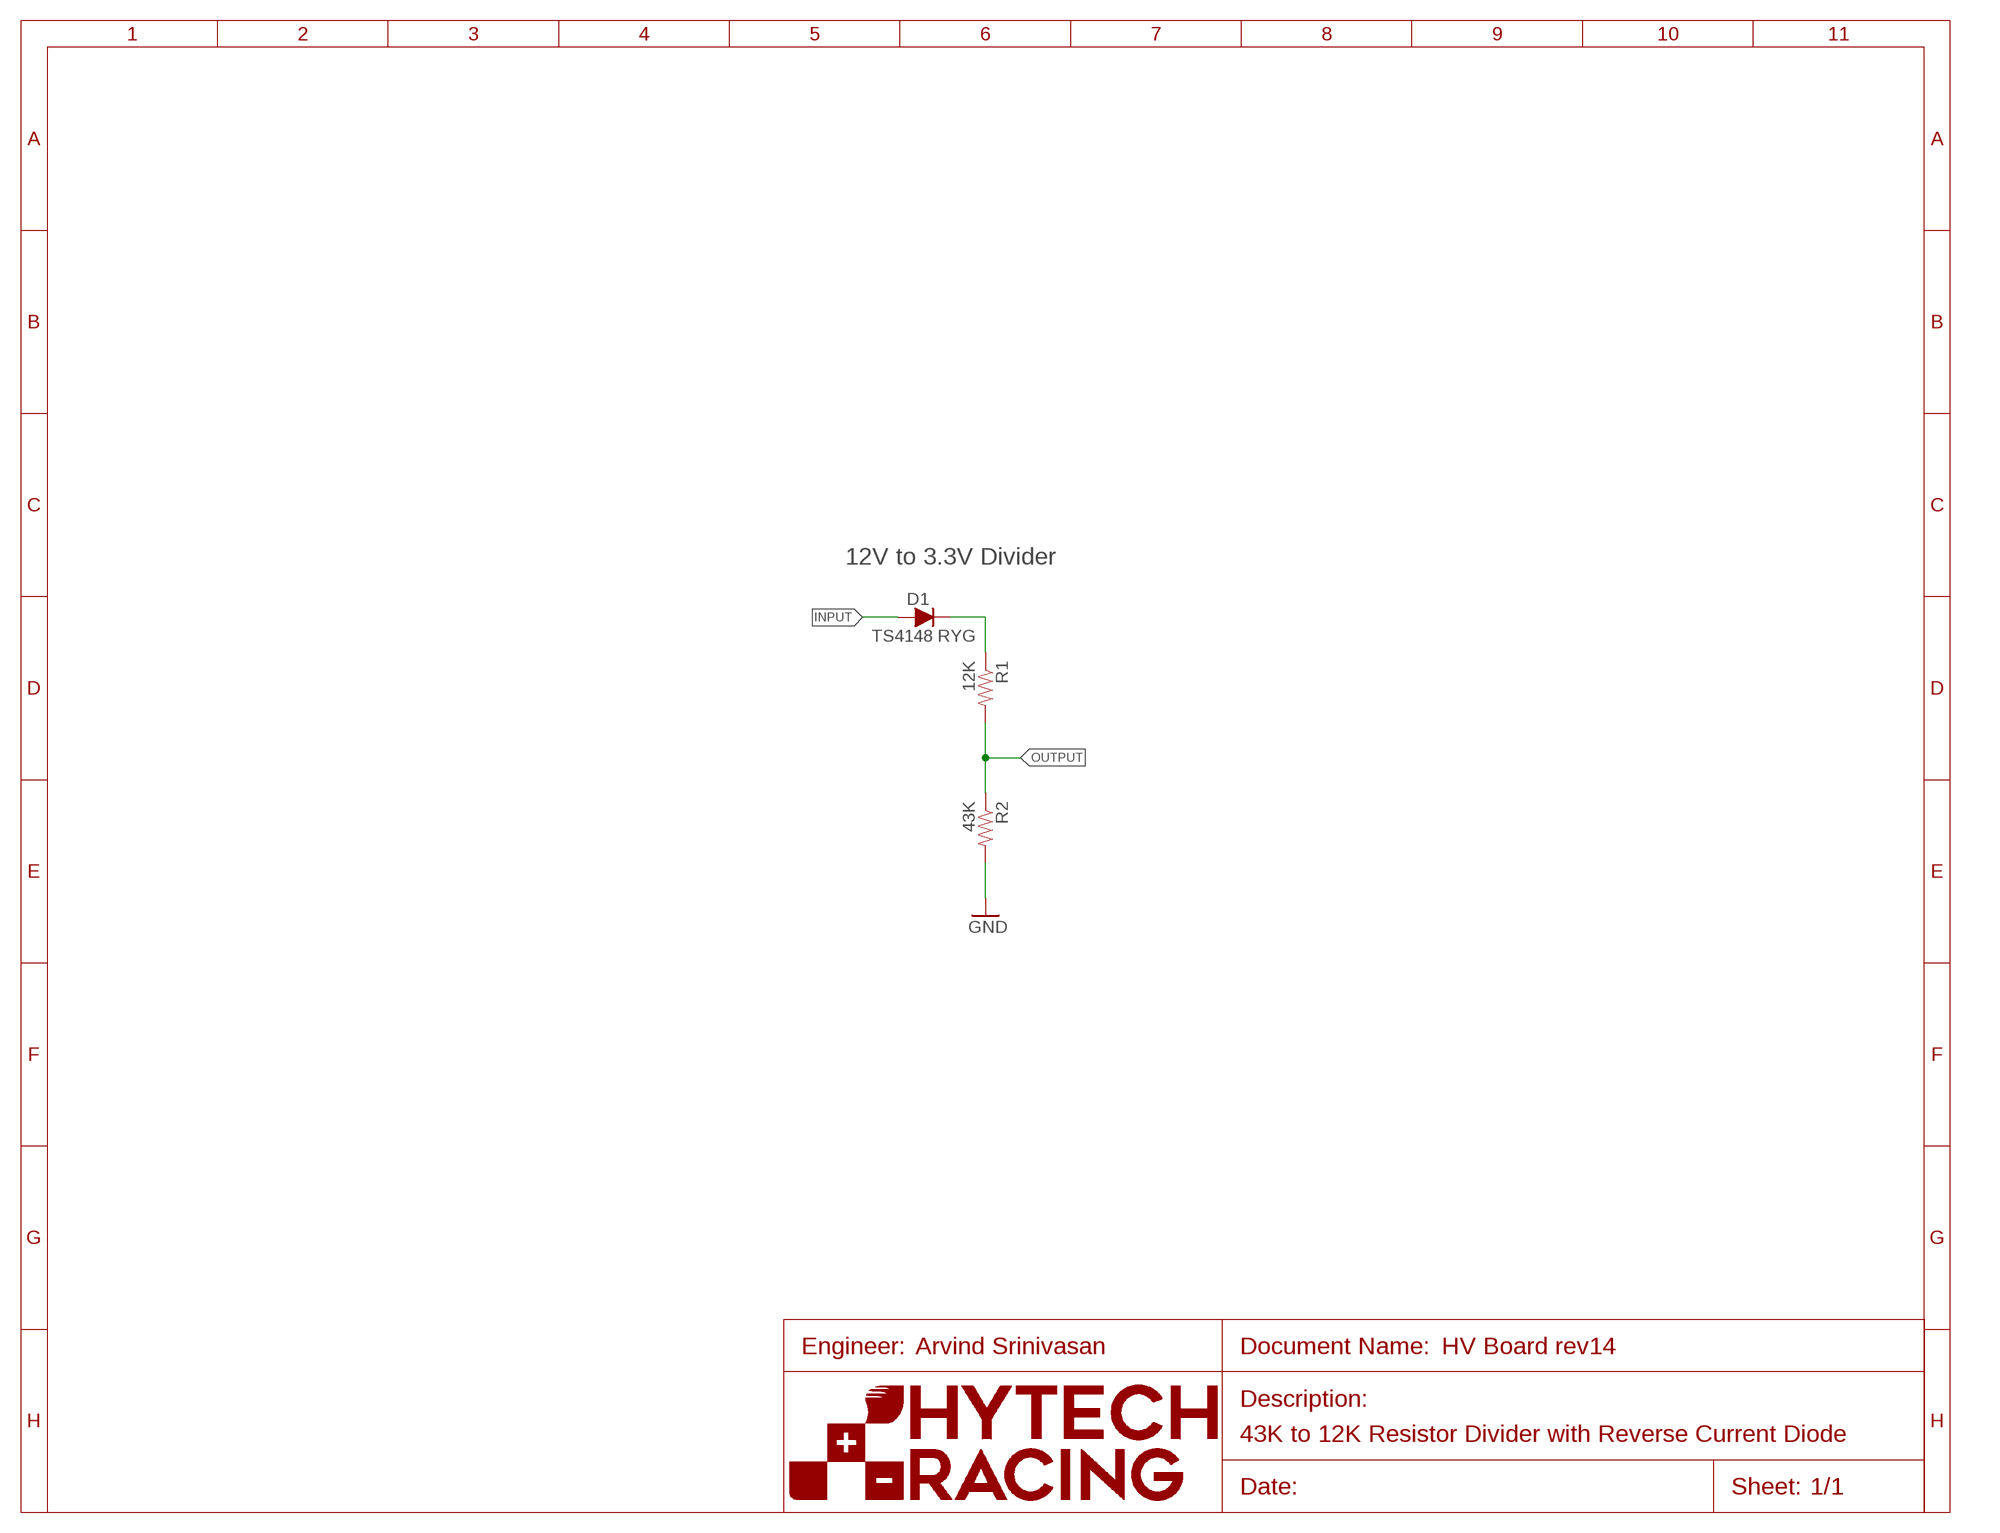
[diagram p3: schematic, module 43/12-RESISTOR-DIVIDER, sheet 1]
U$1 (FRAME_A): FRAME_DESCRIPTION: Default; ORIENTATION: LANDSCAPE; SIZE: A

### Parts
D1  TS4148 RYG  DIODE0805  [0805_D]
R1  12K  RESISTOR0603  [0603-RES@1]
R2  43K  RESISTOR0603  [0603-RES@1]

### Nets
GND: R2.2
INPUT: D1.A
INPUT_POST_DIODE: D1.C R1.1
OUTPUT: R1.2 R2.1

### Notes on the sheet
- 12V to 3.3V Divider
- Arvind Srinivasan
- 43K to 12K Resistor Divider with Reverse Current Diode

### Library data of the parts
D1 = HyTechDevices:DIODE: DIODE general purpose rectifier
R1 R2 = HyTechDevices:RESISTOR: Resistor Basic schematic elements and footprints for 0603, 1206, and PTH resistors.; TOLERANCE: 1%

## Module 10/10-RESISTOR-DIVIDER
Ports: INPUT(in) GND(pwr) OUTPUT(out)
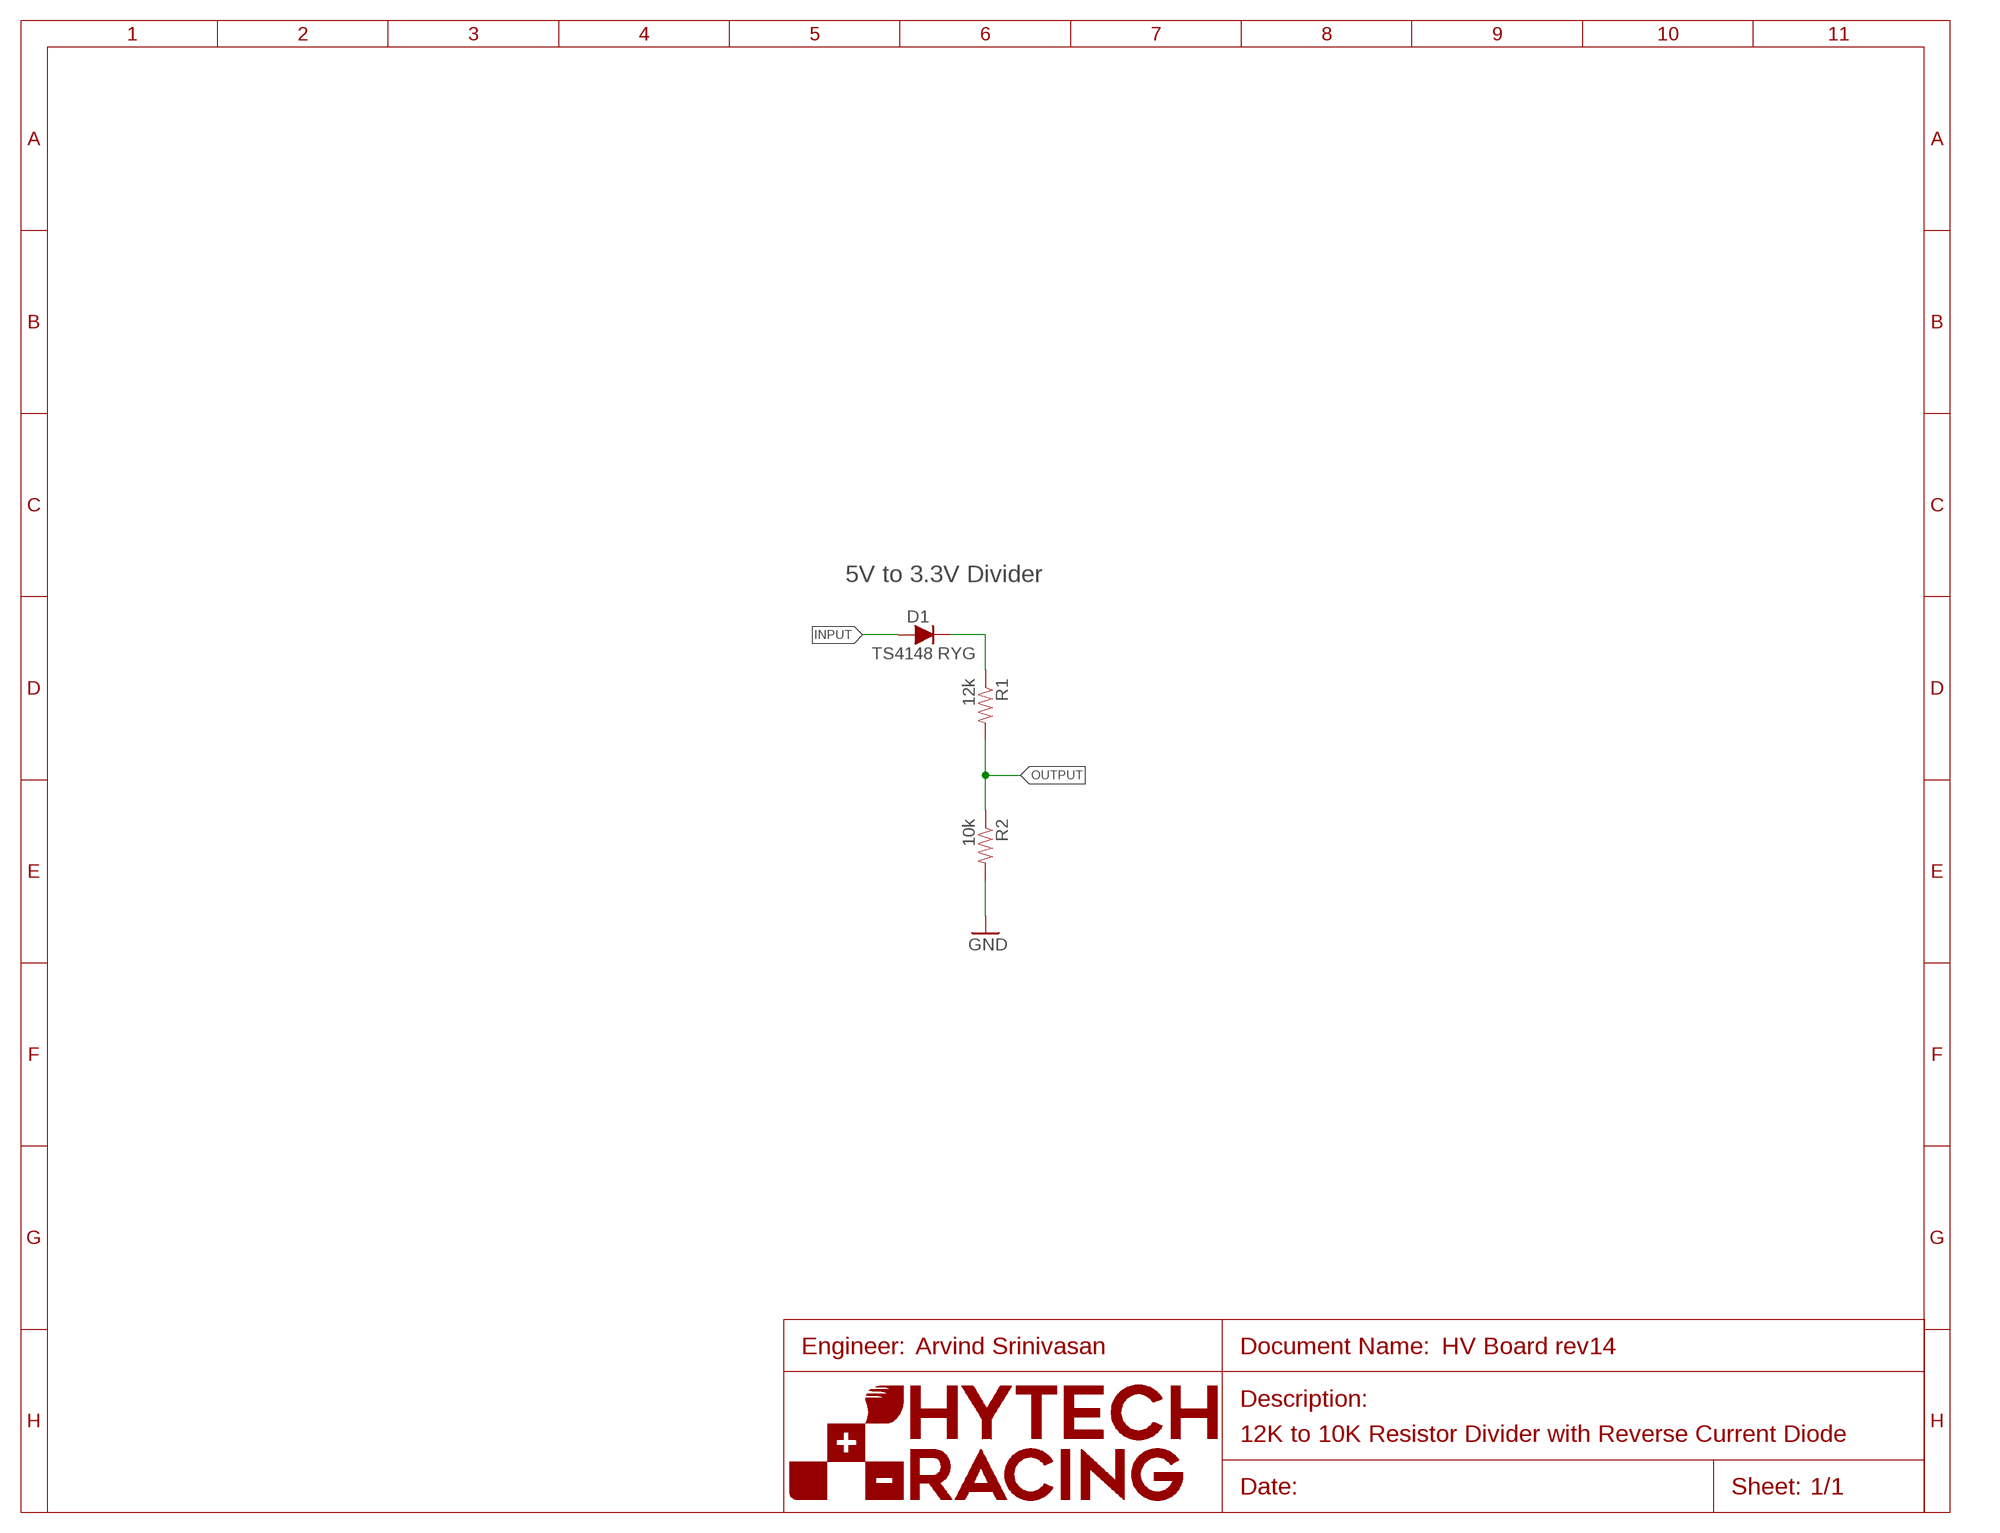
[diagram p4: schematic, module 10/10-RESISTOR-DIVIDER, sheet 1]
U$2 (FRAME_A): FRAME_DESCRIPTION: Default; ORIENTATION: LANDSCAPE; SIZE: A

### Parts
D1  TS4148 RYG  DIODE0805  [0805_D]
R1  12k  RESISTOR0603  [0603-RES@1]
R2  10k  RESISTOR0603  [0603-RES@1]

### Nets
GND: R2.2
INPUT: D1.A
INPUT_POST_DIODE: D1.C R1.1
OUTPUT: R1.2 R2.1

### Notes on the sheet
- 5V to 3.3V Divider
- Arvind Srinivasan
- 12K to 10K Resistor Divider with Reverse Current Diode

### Library data of the parts
D1 = HyTechDevices:DIODE: DIODE general purpose rectifier
R1 R2 = HyTechDevices:RESISTOR: Resistor Basic schematic elements and footprints for 0603, 1206, and PTH resistors.; TOLERANCE: 1%

## Module 1KHZ-FILTER
Ports: +5V(pwr) GND(pwr) OUTPUT(out) INPUT(in)
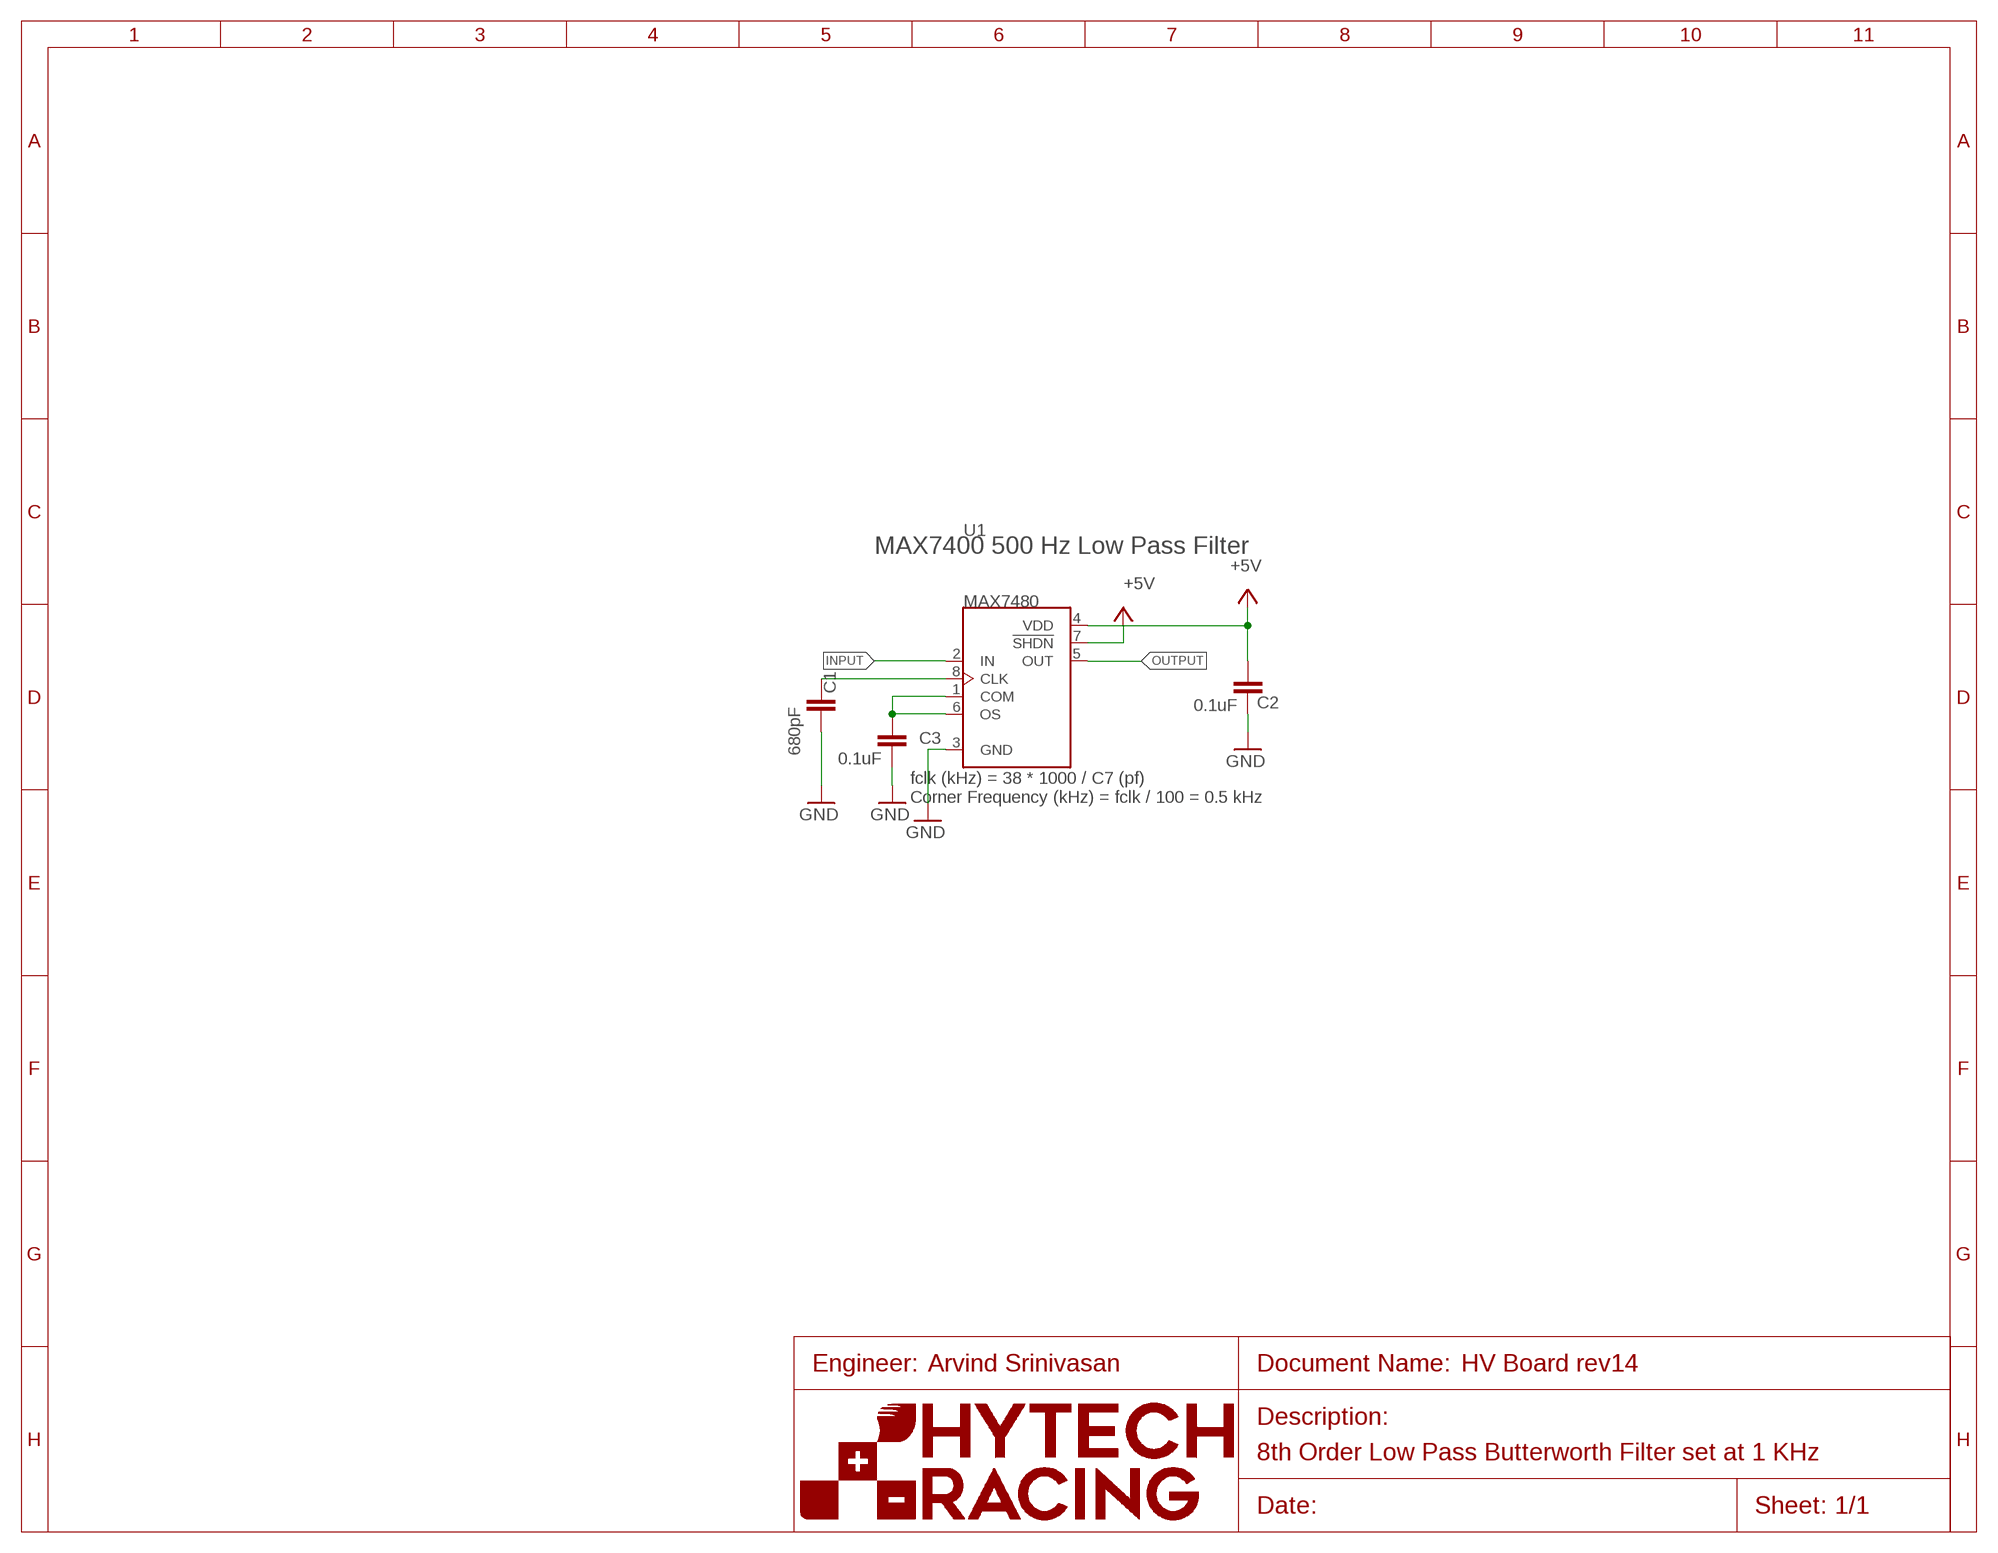
[diagram p5: schematic, module 1KHZ-FILTER, sheet 1]
U$2 (FRAME_A): FRAME_DESCRIPTION: Default; ORIENTATION: LANDSCAPE; SIZE: A

### Parts
C1  680pF  CAP0603-CAP  [0603-CAP@1]
C2  0.1uF  CAP0603-CAP  [0603-CAP@1]
C3  0.1uF  CAP0603-CAP  [0603-CAP@1]
U1  MAX7480  MAX7400  [SOIC-08@2]

### Nets
+5V: C2.1 U1.4(VDD) U1.7(!SHDN)
CLK: C1.1 U1.8(CLK)
COM: C3.1 U1.1(COM) U1.6(OS)
GND: C1.2 C2.2 C3.2 U1.3(GND)
INPUT: U1.2(IN)
OUTPUT: U1.5(OUT)

### Notes on the sheet
- MAX7400 500 Hz Low Pass Filter
- fclk (kHz) = 38 * 1000 / C7 (pf)
  Corner Frequency (kHz) = fclk / 100 = 0.5 kHz
- Arvind Srinivasan
- 8th Order Low Pass Butterworth Filter set at 1 KHz

### Library data of the parts
C1 = HyTechDevices:CAP: Capacitor Standard 0603 ceramic capacitor, and 0.1" leaded capacitor.; TOLERANCE: 1%; VOLTAGE: 10V
C2 C3 = HyTechDevices:CAP: Capacitor Standard 0603 ceramic capacitor, and 0.1" leaded capacitor.; TOLERANCE: 5%; VOLTAGE: 10V
U1 = HyTechDevices:MAX74*: 8th-Order Maxim Filter MAX7480 Datasheet <https://www.mouser.com/datasheet/2/256/MAX7480-1515905.pdf> MAX7400 Datsheet <https://www.mouser.com/datasheet/2/256/MAX7404-1514314.pdf> MAX7404 uses a 680 pF clock capcitor; DKPN: MAX7400CSA+-ND; MANUFACTURER: Maxim Integrated; MOPN: 700-MAX7400CSA; MPN: MAX7400CSA+

## Net classes
1 TS: clearance 2.25 mm to class 0
2 ISO_SPI: clearance 2.25 mm to class 0, clearance 2.25 mm to class 1

## Board
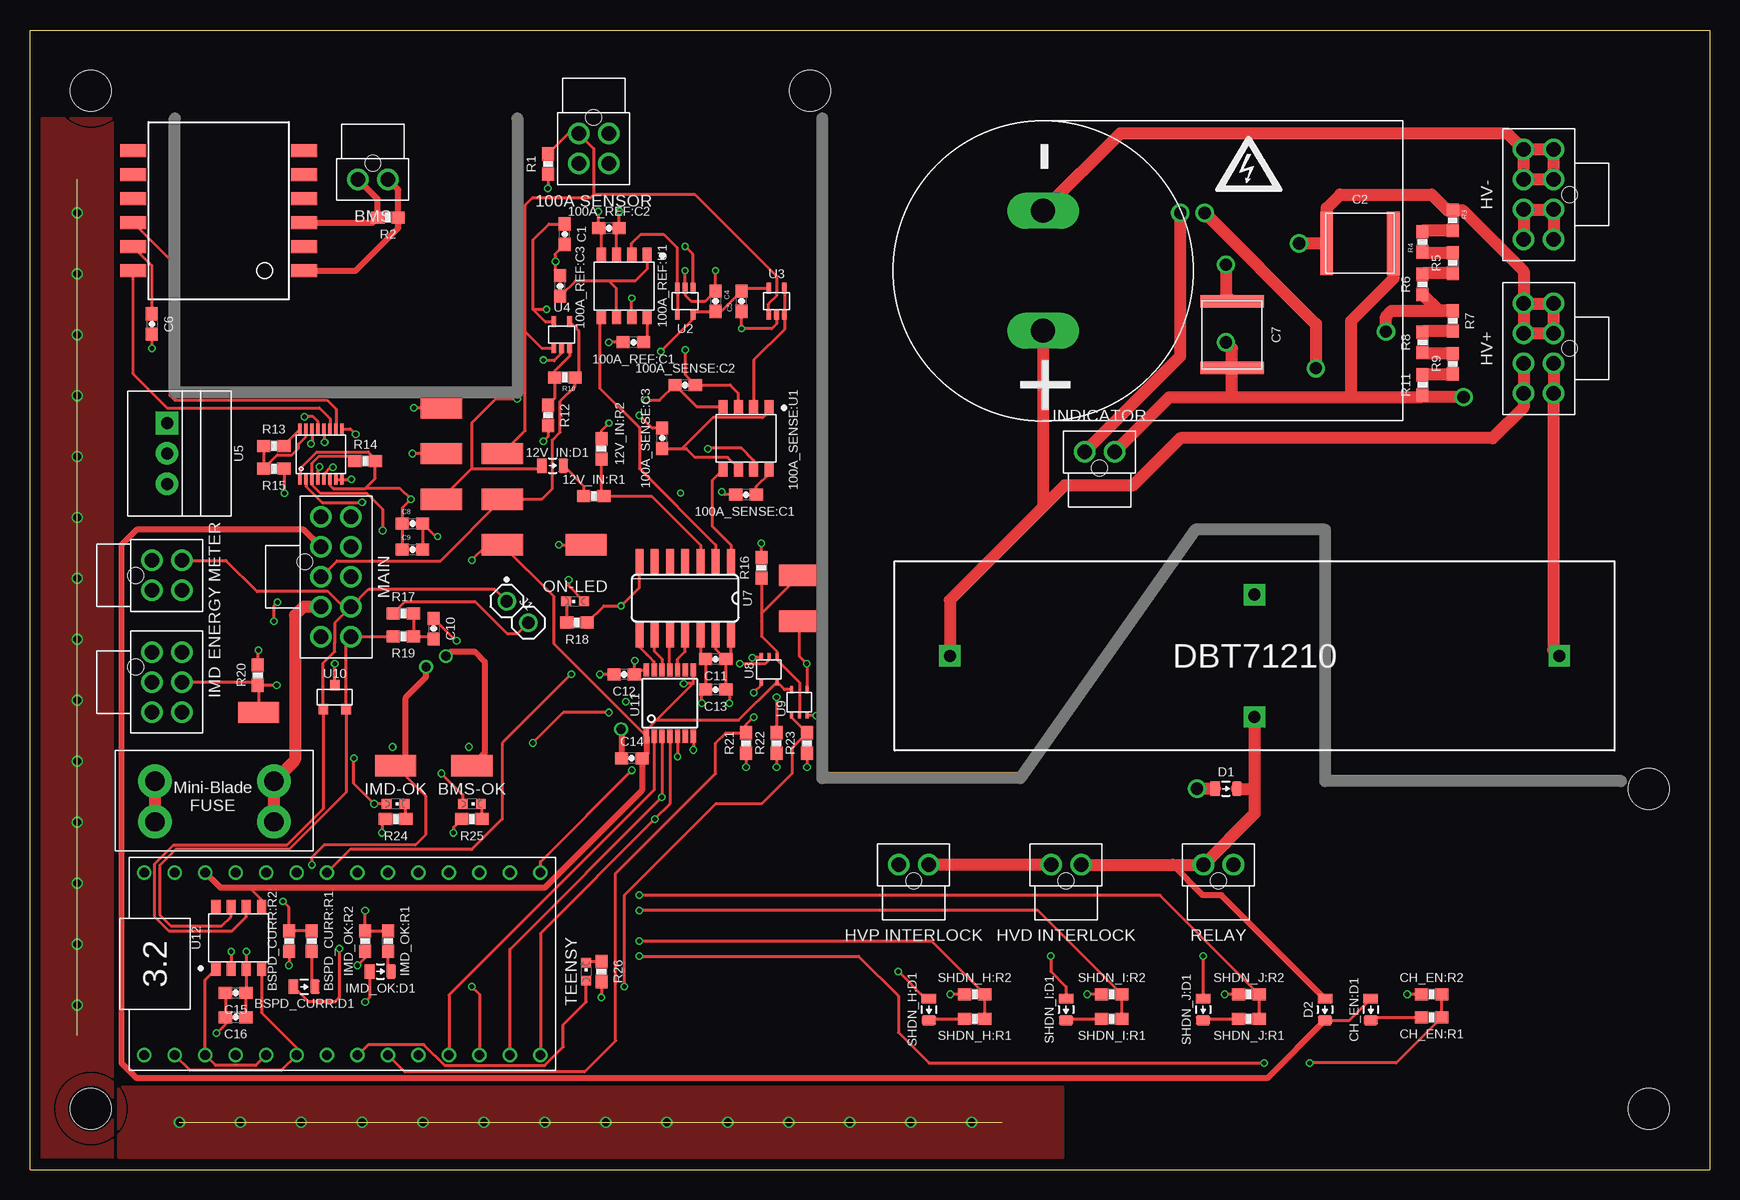
[diagram p6: board, top side]
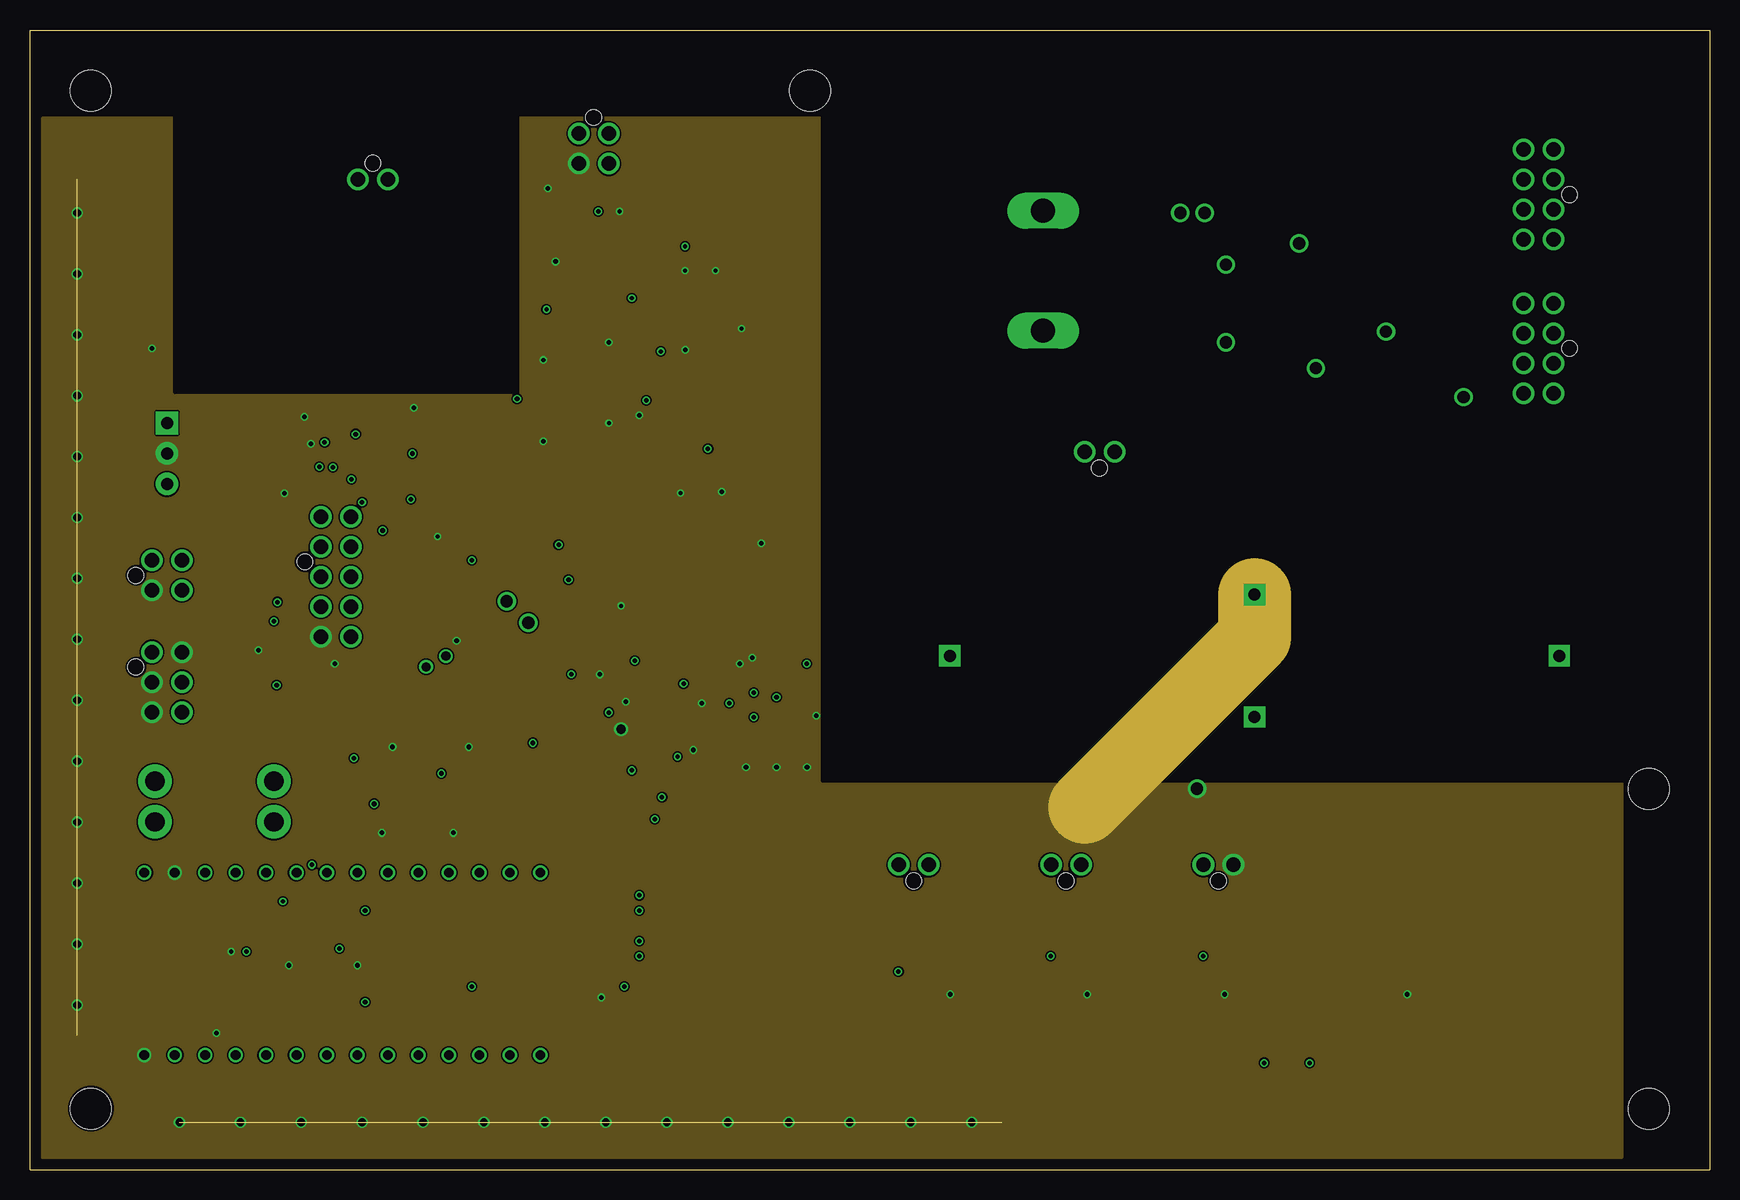
[diagram p7: board, inner layer Route2]
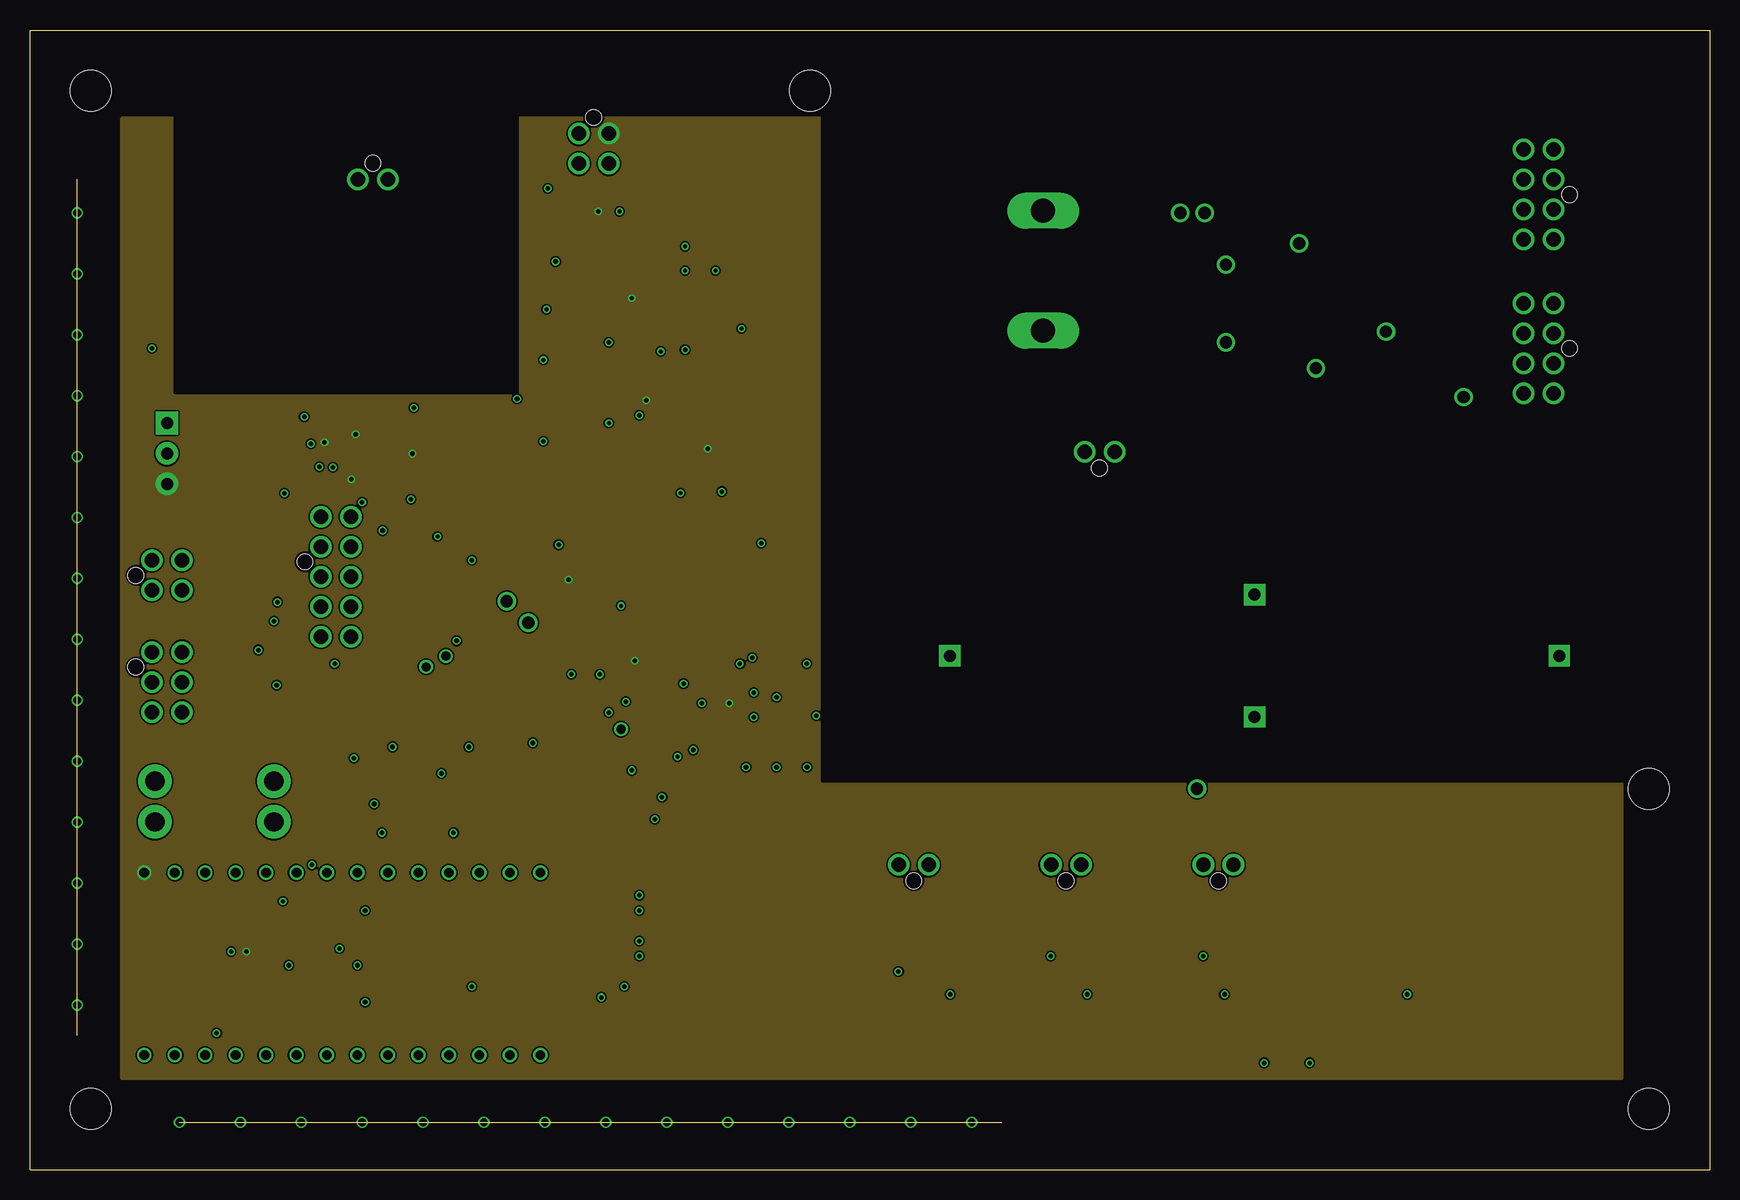
[diagram p8: board, inner layer Route15]
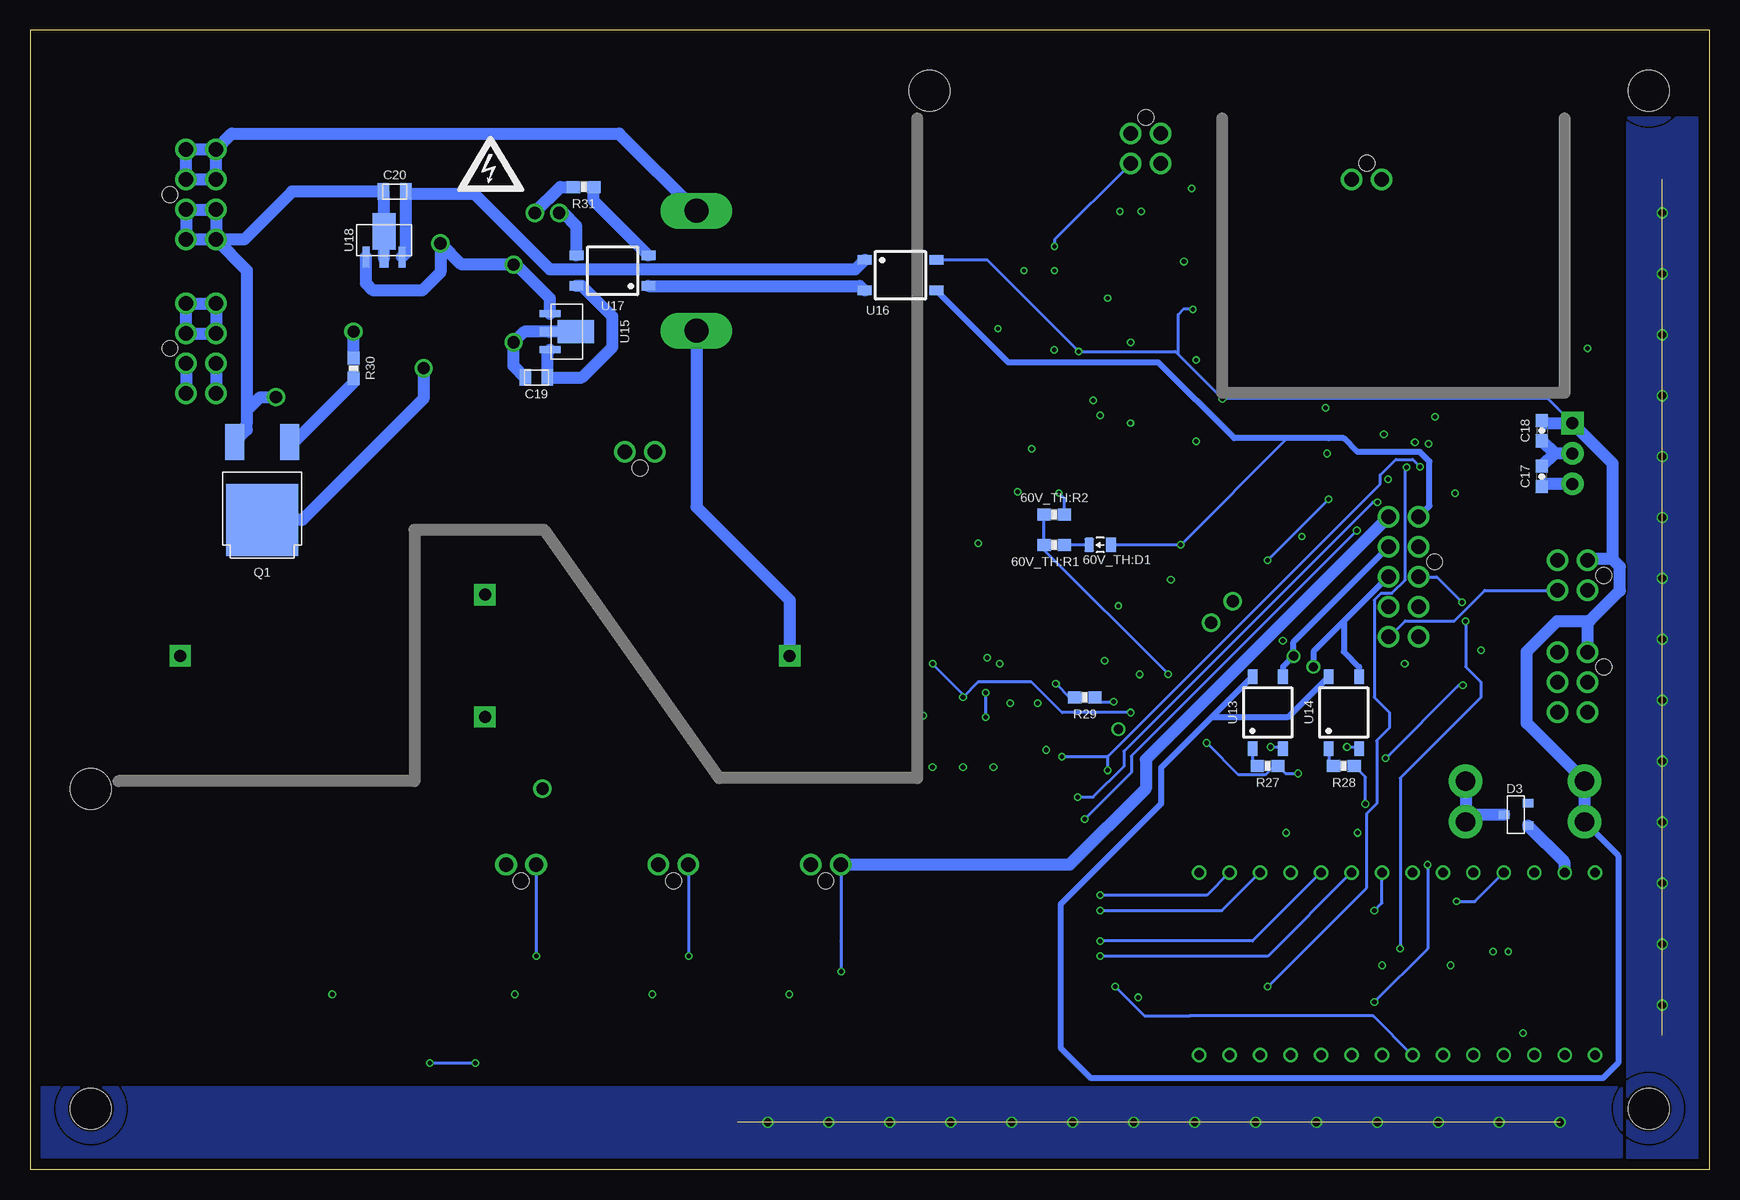
[diagram p9: board, bottom side, seen from below]

Size 140 x 95 mm. Coordinates in mm from the lower left corner, seen from the top.
Outline: 0,0 140,0 140,95 0,95 0,0
Copper layers (1+2*15+16): Top 0.035mm / dielectric 0.2mm / Route2 0.0175mm / dielectric 1.065mm / Route15 0.0175mm / dielectric 0.2mm / Bottom 0.035mm
Design rules "JLCPCB (4 Layer) *": minimum track width 5mil, minimum drill 0.2mm, track to track 5mil, track to pad 5mil, pad to pad 5mil, via to via 20mil, smd to smd 5mil, copper to edge 0.2mm, drill to drill 21mil, minimum pad ring 6mil, minimum via ring 5mil, stop-mask expansion 6mil, vias tented up to drill 30mil, thermal gap 10mil
Milling: 2 lines

### Footprints (pad centres in the part's own frame; a part is rotated, then mirrored left to right if it is on the bottom)
0805_D = smd 0.8 x 1.2: A -0.9,0; C 0.9,0
0603-RES@1 = smd 1.1 x 1: 1 -0.85,0; 2 0.85,0
0603-CAP@1 = smd 1.1 x 1: 1 -0.85,0; 2 0.85,0
SOIC-08@2 = smd 0.762 x 1.143: 1 -1.905,-2.603; 2 -0.635,-2.603; 3 0.635,-2.603; 4 1.905,-2.603; 5 1.905,2.603; 6 0.635,2.603; 7 -0.635,2.603; 8 -1.905,2.603
DBT71210 = drill 1 pad 1.778 square: COIL+ 30,-13; COIL- 30,-2.8; CONTACT1 55.4,-7.9; CONTACT2 4.6,-7.9
M3_MOUNTING = hole 3.4: 0,0
MICRO_MINIATURE = smd 3.429 x 1.778: P$1 0,0
LED-603 = smd 0.8 x 0.8: A 0,-0.75; C 0,0.75
MINI-BLADE_FUSE_HOLDER = drill 1.613 pad 2.794: L1 0,3.404; L2 0,0; R1 9.906,3.404; R2 9.906,0
2220-CAP = smd 1.05 x 5.3: 1 -2.775,0; 2 2.775,0
LLS2V181MELA = drill 2 long: P$1 -5,0; P$2 5,0
0805-CAP = smd 0.95 x 1.4: 1 -0.925,0; 2 0.925,0
NANO-FIT_VERTICAL-4 = drill 1.2: P$1 -1.25,0; P$2 1.25,0; P$3 -1.25,2.5; P$4 1.25,2.5 | hole 1.3: 0,-1.34
SOT-23 = smd 0.711 x 0.889: 1 -0.94,-1.003; 2 0.94,-1.003; 3 0,1.003
MOLEX_NANOFIT_PTH_08 = drill 1.2: 1 3.75,0; 2 1.25,0; 3 -1.25,0; 4 -3.75,0; 5 3.75,-2.5; 6 1.25,-2.5; 7 -1.25,-2.5; 8 -3.75,-2.5 | hole 1.3: 0,1.34
NANO-FIT_VERTICAL-6 = drill 1.2: P$1 -2.5,0; P$2 0,0; P$3 2.5,0; P$4 -2.5,2.5; P$5 0,2.5; P$6 2.5,2.5 | hole 1.3: -1.25,-1.34
NANO-FIT_VERTICAL-2 = drill 1.2: P$1 -1.25,0; P$2 1.25,0 | hole 1.3: 0,-1.34
1X02 = drill 1.016: 1 -1.27,0; 2 1.27,0
NANO-FIT_VERTICAL-10 = drill 1.2: P$1 -5,0; P$2 -2.5,0; P$3 0,0; P$4 2.5,0; P$5 5,0; P$6 -5,2.5; P$7 -2.5,2.5; P$8 0,2.5; P$9 2.5,2.5; P$10 5,2.5 | hole 1.3: -1.27,-1.34
DPAK(2-7K1S) = smd 1.6 x 3: 1 -2.3,-3.5; 3 2.3,-3.5 | smd 6 x 6: 2 0,3
TEENSY_3.2_SIMPLE = drill 0.8: 3.3V 16.51,29.21; A0 16.51,3.81; A1 16.51,6.35; A2 16.51,8.89; A3 16.51,11.43; A4 16.51,13.97; A5 16.51,16.51; A6 16.51,19.05; A7 16.51,21.59; A8 16.51,24.13; A9 16.51,26.67; AGND 16.51,31.75; D0(RX1) 1.27,31.75; D1(TX1) 1.27,29.21; D2 1.27,26.67; D3(CANTX) 1.27,24.13; D4(CANRX) 1.27,21.59; D5 1.27,19.05; D6 1.27,16.51; D7(RX3) 1.27,13.97; D8(TX3) 1.27,11.43; D9(RX2) 1.27,8.89; D10(TX2) 1.27,6.35; D11 1.27,3.81; D12 1.27,1.27; D13 16.51,1.27; GND 1.27,34.29; VIN 16.51,34.29
HM2102NLT = smd 1.067 x 2.184: P$1 0,0; P$2 2,0; P$3 4,0; P$4 6,0; P$5 8,0; P$6 10,0; P$7 10,14.25; P$8 8,14.25; P$9 6,14.25; P$10 4,14.25; P$11 2,14.25; P$12 0,14.25
SC-70-5 = smd 0.4 x 0.9: 1 -0.65,-1.1; 2 0,-1.1; 3 0.65,-1.1; 4 0.65,1.1; 5 -0.65,1.1
OKI-78SR@1 = drill 1 pad 1.88 square: 1 -2.54,0 | drill 1 pad 1.88: 2 0,0; 3 2.54,0
MSOP-16 = smd 0.305 x 0.889: 1 -0.1,-0.5; 2 0.4,-0.5; 3 0.9,-0.5; 4 1.4,-0.5; 5 1.9,-0.5; 6 2.4,-0.5; 7 2.9,-0.5; 8 3.4,-0.5; 9 3.4,3.7; 10 2.9,3.7; 11 2.4,3.7; 12 1.9,3.7; 13 1.4,3.7; 14 0.9,3.7; 15 0.4,3.7; 16 -0.1,3.7
SO14 = smd 0.66 x 2.032: 1 -3.81,-3.073; 2 -2.54,-3.073; 3 -1.27,-3.073; 4 0,-3.073; 5 1.27,-3.073; 6 2.54,-3.073; 7 3.81,-3.073; 8 3.81,3.073; 9 2.54,3.073; 10 1.27,3.073; 11 0,3.073; 12 -1.27,3.073; 13 -2.54,3.073; 14 -3.81,3.073
SOT323-5 = smd 0.61 x 0.254: 1 -2.108,1.295; 2 -2.108,0.635; 3 -2.108,0; 4 0,0; 5 0,1.295
SOT23 = smd 0.8 x 0.9: 1 -0.95,-1; 2 0.95,-1; 3 0,1
TSSOP-14 = smd 0.45 x 1.1: 1 -1.958,-2.618; 2 -1.308,-2.618; 3 -0.657,-2.618; 4 -0.007,-2.618; 5 0.642,-2.618; 6 1.292,-2.618; 7 1.942,-2.618; 8 1.942,2.918; 9 1.292,2.918; 10 0.642,2.918; 11 -0.007,2.918; 12 -0.657,2.918; 13 -1.308,2.918; 14 -1.958,2.918
SOIC-08 = smd 0.762 x 1.143: 1 -1.905,-2.603; 2 -0.635,-2.603; 3 0.635,-2.603; 4 1.905,-2.603; 5 1.905,2.603; 6 0.635,2.603; 7 -0.635,2.603; 8 -1.905,2.603
SOP04 = smd 0.8 x 1.2: 1 -1.27,-3; 2 1.27,-3; 3 1.27,3; 4 -1.27,3
SOT89 = smd 0.58 x 1.73: 1 -1.5,-1.4; 3 1.5,-1.4 | smd 0.76 x 1.5: 2 0,-1.515 | smd 1.933 x 3.03: 2@2 0,0.75

### Placement (x,y rotation side)
12V_IN:D1  TS4148 RYG  [0805_D]  43.56,58.67 0 top
12V_IN:R1  12K  [0603-RES@1]  46.99,56.13 0 top
12V_IN:R2  43K  [0603-RES@1]  47.62,60.07 90 top
60V_TH:D1  TS4148 RYG  [0805_D]  50.8,52.07 180 bottom
60V_TH:R1  12K  [0603-RES@1]  54.61,52.07 180 bottom
60V_TH:R2  43K  [0603-RES@1]  54.61,54.61 0 bottom
100A_REF:C1  680pF  [0603-CAP@1]  50.29,68.96 180 top
100A_REF:C2  0.1uF  [0603-CAP@1]  48.26,78.49 0 top
100A_REF:C3  0.1uF  [0603-CAP@1]  44.2,73.66 90 top
100A_REF:U1  MAX7480  [SOIC-08@2]  49.53,73.66 180 top
100A_SENSE:C1  680pF  [0603-CAP@1]  59.69,56.26 180 top
100A_SENSE:C2  0.1uF  [0603-CAP@1]  54.61,65.41 0 top
100A_SENSE:C3  0.1uF  [0603-CAP@1]  52.7,60.96 90 top
100A_SENSE:U1  MAX7480  [SOIC-08@2]  59.69,60.96 180 top
$$$$U$3  132.08,34.92 180 top
$$U$1  [M3_MOUNTING]  5.08,89.92 0 top
$$U$2  [M3_MOUNTING]  65.02,89.92 0 top
$$U$3  34.29,59.69 0 top
$$U$12  30.48,33.66 0 top
BMS-OK  36.83,30.48 270 top
BOARDFUSE  20.32,32.38 180 top
BSPD_CURR:D1  TS4148 RYG  [0805_D]  22.86,15.24 0 top
BSPD_CURR:R1  12K  [0603-RES@1]  23.5,19.05 90 top
BSPD_CURR:R2  43K  [0603-RES@1]  21.59,19.05 270 top
C1  44.58,77.98 90 top
C2  110.87,77.22 0 top
C3  84.45,74.93 90 top
C4  57.15,72.39 270 top
C5  59.31,72.39 90 top
C6  10.16,70.48 270 top
C7  100.2,69.6 270 top
C8  31.88,53.85 0 top
C9  31.88,51.69 0 top
C10  33.66,45.09 270 top
C11  57.15,42.55 180 top
C12  49.53,41.27 180 top
C13  57.15,40.01 180 top
C14  50.16,34.29 180 top
C15  17.14,14.73 0 top
C16  17.14,12.7 0 top
C17  13.97,57.78 90 bottom
C18  13.97,61.59 270 bottom
C19  97.79,66.04 180 bottom
C20  109.6,81.53 180 bottom
CH_EN:D1  TS4148 RYG  [0805_D]  111.76,13.34 270 top
CH_EN:R1  12K  [0603-RES@1]  116.84,12.7 0 top
CH_EN:R2  43K  [0603-RES@1]  116.84,14.61 180 top
CURRENT1  46.99,86.36 180 top
D1  99.69,31.75 0 top
D2  107.95,13.34 270 top
D3  16.13,29.59 90 bottom
ENERGYMETER  10.16,49.53 270 top
HV+  127,68.45 270 top
HV-  127,81.28 270 top
IMD  10.16,40.64 270 top
IMD-OK  30.48,30.48 270 top
IMD_OK:D1  TS4148 RYG  [0805_D]  29.21,16.51 0 top
IMD_OK:R1  12K  [0603-RES@1]  29.84,19.05 90 top
IMD_OK:R2  43K  [0603-RES@1]  27.94,19.05 270 top
INDICATOR  89.15,59.82 0 top
INTERLOCK1  73.66,25.4 0 top
INTERLOCK2  86.36,25.4 0 top
ISOSPI  28.57,82.55 180 top
J1  40.64,46.48 315 top
MAIN  24.26,49.4 270 top
ON-LED  45.44,47.37 90 top
Q1  120.65,57.15 180 bottom
R1  43.18,83.82 270 top
R2  29.84,79.38 180 top
R3  118.62,79.12 270 top
R4  116.08,77.34 90 top
R5  118.62,75.56 270 top
R6  116.08,73.79 90 top
R7  118.62,70.74 90 top
R8  116.08,68.96 270 top
R9  118.62,67.18 90 top
R10  44.58,66.04 180 top
R11  116.08,65.41 270 top
R12  43.18,62.87 270 top
R13  20.32,60.33 180 top
R14  27.94,59.05 180 top
R15  20.32,58.42 0 top
R16  60.96,50.16 270 top
R17  31.11,46.35 180 top
R18  45.59,45.59 0 top
R19  31.11,44.45 180 top
R20  19,41.22 90 top
R21  59.69,35.56 270 top
R22  62.23,35.56 90 top
R23  64.77,35.56 90 top
R24  30.48,29.21 180 top
R25  36.83,29.21 180 top
R26  47.62,16.51 270 top
R27  36.83,33.66 180 bottom
R28  30.48,33.66 180 bottom
R29  52.07,39.37 0 bottom
R30  113.03,66.8 270 bottom
R31  93.85,81.92 180 bottom
RELAY  99.06,25.4 0 top
SHDN_H:D1  TS4148 RYG  [0805_D]  74.93,13.34 270 top
SHDN_H:R1  12K  [0603-RES@1]  78.74,12.57 0 top
SHDN_H:R2  43K  [0603-RES@1]  78.74,14.61 180 top
SHDN_I:D1  TS4148 RYG  [0805_D]  86.36,13.34 270 top
SHDN_I:R1  12K  [0603-RES@1]  90.17,12.57 0 top
SHDN_I:R2  43K  [0603-RES@1]  90.17,14.61 180 top
SHDN_J:D1  TS4148 RYG  [0805_D]  97.79,13.34 270 top
SHDN_J:R1  12K  [0603-RES@1]  101.6,12.57 0 top
SHDN_J:R2  43K  [0603-RES@1]  101.6,14.61 180 top
TEENSY  46.35,16.51 0 top
TEENSY3.1  43.81,8.26 90 top
U1  22.86,74.93 90 top
U2  54.61,72.39 180 top
U3  62.23,72.39 0 top
U4  44.32,69.6 0 top
U5  11.43,59.69 270 top
U6  22.61,58.04 0 top
U7  54.61,47.62 180 top
U8  60.96,40.64 270 top
U9  64.77,40.01 90 top
U10  25.4,39.37 0 top
U11  53.34,38.73 0 top
U12  17.4,19.3 0 top
U13  36.83,38.1 0 bottom
U14  30.48,38.1 0 bottom
U15  95.25,69.85 270 bottom
U16  67.44,74.55 270 bottom
U17  91.44,74.93 90 bottom
U18  110.49,77.47 0 bottom
U$3  34.29,63.5 0 top
U$4  39.37,59.69 0 top
U$5  34.29,55.88 0 top
U$6  39.37,55.88 0 top
U$7  39.37,52.07 0 top
U$8  46.35,52.07 0 top
U$9  64.14,49.53 0 top
U$10  64.14,45.72 0 top
U$11  19.05,38.1 0 top
U$13  36.83,33.66 0 top
U$14  [M3_MOUNTING]  134.92,31.75 0 top
U$15  [M3_MOUNTING]  5.08,5.08 0 top
U$16  [M3_MOUNTING]  134.92,5.08 0 top
U$17  [HV_0.50"]  101.6,83.82 0 bottom
U$19  [HV_0.50"]  101.6,83.82 0 top

### Tracks (layer width: path | path; a pad name or v marks a point on that pad's centre or on a via)
12V_IN:INPUT_POST_DIODE
  Top 0.254: 12V_IN:D1.C 46.14,56.99 12V_IN:R1.1
60V_TH:INPUT_POST_DIODE
  Bottom 0.254: 60V_TH:D1.C 60V_TH:R1.1
60V_THRESHOLD_SIGNAL  (via drill 0.38)
  Top 0.254: v44.07,52.07 U$8.P$1
  Bottom 0.254: 31.75,60.96 35.18,60.96 v44.07,52.07 60V_TH:D1.A
  Bottom 0.508: MAIN.P$1 23.35,55.31 23.35,59.03 24.13,59.82 29.34,59.82 30.48,60.96 31.75,60.96 39.62,60.96 45.97,67.31 55.88,67.31 58.47,67.31 U16.3
60V_THRESHOLD_TEENSY  (via drill 0.38)
  Top 0.254: v45.11,41.3 39.37,35.56 39.37,29.21 36.83,26.67 26.67,26.67 TEENSY3.1.A6
  Bottom 0.254: v45.11,41.3 55.46,51.65 60V_TH:R1.2 60V_TH:R2.1
100A_REF  (via drill 0.35)
  Top 0.254: U2.1 55.26,76.31 v54.61,76.96
  Bottom 0.254: v54.61,76.96 54.59,76.96 54.59,77.51 CURRENT1.P$3
100A_REF:CLK
  Top 0.254: 100A_REF:U1.8 51.44,69.25 100A_REF:C1.1
100A_REF:COM
  Top 0.254: 48.26,74.08 50.46,74.08 51.44,75.06 100A_REF:U1.1 | 48.26,74.08 45.47,74.08 100A_REF:C3.1 | 48.26,74.08 48.9,73.44 100A_REF:U1.6
100A_REF_BUFF
  Top 0.254: U2.4 U2.3 53.96,76.82 52.8,77.98 50.93,77.98 50.16,77.22 100A_REF:U1.2
100A_REF_FILT
  Top 0.254: 100A_REF:U1.5 47.5,70.93 47.5,65.15 50.8,61.85 50.8,58.42 57.15,52.07 U7.2
100A_SENSE
  Top 0.254: R1.1 44.87,86.36 CURRENT1.P$2 46.99,85.11 46.99,81.28 | U$4.P$1 41.27,61.59 41.27,69.85 | 41.27,69.85 41.27,80.39 41.91,81.03 46.74,81.03 46.99,81.28 | 41.27,69.85 42.63,68.5 U4.1 | U3.1 61.58,72.18 62.23,72.83 62.23,74.48 55.43,81.28 46.99,81.28
100A_SENSE:CLK
  Top 0.254: 100A_SENSE:U1.8 61.59,57.98 60.54,56.92 100A_SENSE:C1.1
100A_SENSE:COM
  Top 0.254: 100A_SENSE:U1.6 59.05,58.48 58.17,59.37 55.44,59.37 54.7,60.11 100A_SENSE:C3.1 54.36,60.11 56.92,62.67 61.09,62.67 61.59,63.18 100A_SENSE:U1.1
100A_SENSE_BUFF
  Top 0.254: U3.4 U3.3 62.88,70.02 60.33,67.47 100A_SENSE:U1.2
100A_SENSE_FILT
  Top 0.254: 100A_SENSE:U1.5 56.86,57.44 56.86,53.63 58.42,52.07 U7.1
+3V3  (via drill 0.38)
  Top 0.254: U9.5 62.89,40.01 U8.5 59.08,37.47 52.25,37.47 | 52.25,37.47 51.43,36.65 51.43,36.16 U11.1 44.2,43.3 44.2,43.31 43.69,43.81 43.69,47.75 U$7.P$1 38.1,52.07 v36.83,50.8 | U11.8 55.28,40.5 | 55.28,40.5 52.25,37.47 | 27.94,56.77 25.27,56.77 25.01,57.04 U6.6 | 27.94,56.77 28.79,57.62 R14.1 28.79,59.22 28.19,59.82 23.9,59.82 22.51,58.42 U6.1 | 27.94,56.77 30.86,56.77 v31.75,55.88 31.03,55.16 C8.1 C9.1 | 55.28,40.5 55.27,40.51 v54.48,40.51 | U12.5 19.3,22.5 18.29,23.51
  Top 0.508: U11.1 51.38,34.66 C14.1 51.02,31.59 42.93,23.51 18.29,23.51 15.86,23.51 TEENSY3.1.3.3V
  Bottom 0.254: v36.83,50.8 v31.75,55.88 | v54.48,40.51 53.34,39.37 R29.1
+5V  (via drill 0.35, 0.38)
  Top 0.254: 100A_REF:U1.4 47.62,78.27 100A_REF:C2.1 47.41,79.84 v47.37,79.88 | 100A_SENSE:U1.4 55.6,63.56 100A_SENSE:C2.1 52.49,64.14 v51.39,64.14 | $$U$3.P$1 v31.88,59.69 | 100A_SENSE:U1.7 60.33,59.12 59.31,60.13 56.58,60.13 v56.52,60.07 | C11.1 C13.1 58.29,39.71 v58.29,38.88 | U6.7 U6.8 v26.79,57.54 v26.8,57.53 | U11.14 50.76,41.65 C12.1 50.38,42.38 v50.42,42.42 | v27.14,61.31 26.71,61.74 U6.9 | U6.12 24.51,60.67 v24.56,60.62 | v44.9,49.18 44.9,48.67 ON-LED.A | C11.1 58.42,42.97 U7.14 | U7.13 57.15,43.4 C11.1 | 100A_REF:U1.7 v50.16,72.64 | C16.2 C15.2 18.03,14.77 U12.3 v18.03,18.16
  Bottom 1.016: U5.3 13.76,57.15 C17.1
  pour Route2 (rank 2): 12.06,87.63 12.06,64.77 40.64,64.77 40.64,87.63
  pour Route15 (no thermals): 7.62,87.63 7.62,7.62 132.72,7.62 132.72,87.63
+12V  (via drill 0.35, 0.38)
  Top 0.254: U$5.P$1 36.83,58.42 | 36.83,58.42 36.83,62.23 38.86,64.26 v40.6,64.26 | C1.2 43.27,78.83 41.91,77.47 41.91,71.72 41.93,71.7 | U3.5 59.56,73.49 C5.2 57.61,71.54 C4.2 55.51,71.54 U2.5 55.26,70.88 v52.58,68.2 | 12V_IN:D1.A 42.41,58.42 36.83,58.42 | v43.05,71.7 41.93,71.7 | 41.93,71.7 42.94,70.7 U4.5
  Top 1.016: BOARDFUSE.R2 BOARDFUSE.R1
  Bottom 0.254: U5.1 13.46,64.26 v40.6,64.26 44.28,67.94 | 44.28,67.94 44.54,68.2 v52.58,68.2 60.2,75.82 U16.4 | 44.28,67.94 44.28,71.28 43.81,71.75 43.05,71.75 v43.05,71.7
  Bottom 0.508: BOARDFUSE.R1 7.62,26.19 7.62,8.89 8.89,7.62 51.56,7.62 54.1,10.16 54.1,22.1 45.72,30.48 45.72,33.48 41.51,37.7 | U13.4 41.51,37.7 | U14.4 35.16,37.7 41.51,37.7
  Bottom 1.016: BOARDFUSE.R1 BOARDFUSE.R2 15.24,37.21 15.24,43.18 12.7,45.72 10,45.72 | 8.09,50.89 10.05,50.89 ENERGYMETER.P$1 | 8.09,50.89 7.46,50.26 7.46,48.26 10,45.72 | 8.09,50.89 8.09,58.89 U5.1 13.76,62.23 C18.1 | IMD.P$1 10.16,45.56 10,45.72
+12V_SCALED_3.3V
  Top 0.254: 12V_IN:R2.1 47.62,56.35 12V_IN:R1.2 49.53,56.13 50.16,56.13 51.82,56.13 55.88,52.07 U7.3
+12VIN
  Top 1.016: BOARDFUSE.L1 BOARDFUSE.L2 22.1,34.16 22.1,46.23 22.77,46.9 MAIN.P$4
  Bottom 1.016: BOARDFUSE.L2 BOARDFUSE.L1 19.71,29.59 D3.3
BMS_OK  (via drill 0.76)
  Top 0.508: v34.67,42.8 35.05,43.18 37.08,43.18 37.93,42.33 37.93,39.62 37.93,34.76 U$13.P$1
  Bottom 0.508: MAIN.P$7 26.76,51.88 34.67,43.96 v34.67,42.8 35.56,41.91 U13.3
BMS_OK_3.3V  (via drill 0.38)
  Top 0.254: v62.23,39.37 R22.2 | v41.91,35.56 44.45,38.1 v48.26,38.1 | v34.29,33.02 36.08,31.23 BMS-OK.A | U9.4 v64.77,42.14 v64.76,42.15 64.14,42.78 64.14,43.18 U$10.P$1
  Bottom 0.254: v64.76,42.15 62.23,39.62 v62.23,39.37 60.96,40.64 56.52,40.64 53.98,38.1 v48.26,38.1 | v41.91,35.56 39.25,32.9 37.02,32.9 36.27,33.66 R27.1 35.34,33.02 v34.29,33.02
BMS_STATUS  (via drill 0.38)
  Top 0.254: U9.1 63.48,37.7 R23.2 63.5,35.14 63.5,33.02 60.96,30.48 57.15,30.48 49.53,22.86 v49.53,15.24
  Bottom 0.254: TEENSY3.1.D5 28.04,12.8 43.35,12.8 47.09,12.8 v49.53,15.24
BSPD_CURR:INPUT_POST_DIODE
  Top 0.254: BSPD_CURR:R1.1 23.5,15.51 BSPD_CURR:D1.C
BSPD_CURR_TEENSY  (via drill 0.35)
  Top 0.254: BSPD_CURR:R1.2 BSPD_CURR:R2.1 21.59,21.84 v21.08,22.35
  Bottom 0.254: v21.08,22.35 19.56,22.35 TEENSY3.1.A9
BSPD_CURRENT  (via drill 0.38)
  Top 0.254: MAIN.P$3 25.6,50.75 34.24,50.75 U$6.P$1 42.67,55.88 43.56,56.77 43.56,60.83 44.2,61.47 44.2,64.05 45.43,65.28 R10.1 45.72,66.33 45.72,69.95 U4.4 | v20.64,47.31 20.32,46.99 v20.32,45.72 | v25.78,18.41 25.78,14.35 25.4,13.97 23.23,13.97 BSPD_CURR:D1.A
  Bottom 0.254: MAIN.P$3 22.73,49.4 v20.64,47.31 | v20.32,45.72 20.32,41.91 19.05,40.64 19.05,39.37 25.78,32.64 v25.78,18.41
CANH
  Top 0.254: R19.2 26.8,44.45 MAIN.P$10 26.35,44 U10.2 26.35,31.43 21.59,26.67 12.13,26.67 10.83,25.37 10.83,21.21 11.74,20.3 15.98,20.3 16.76,21.08 U12.7
  Bottom 0.254: ENERGYMETER.P$4 18.75,48.28 21.28,45.75 25.37,45.75 26.72,44.4 MAIN.P$10
CANL
  Top 0.254: MAIN.P$9 25.41,45.56 25.41,43.92 25.4,43.91 25.4,43.18 24.45,42.23 U10.1 24.45,30.07 21.43,27.05 11.97,27.05 10.41,25.5 10.41,21.05 11.55,19.91 16.87,19.91 18.03,21.08 U12.6 | MAIN.P$9 26.14,46.9 24.86,48.18 18.92,48.18 16.33,50.78 ENERGYMETER.P$3 | J1.1 38.73,48.39 28.24,48.39 MAIN.P$9
CANRX
  Top 0.254: TEENSY3.1.D0(RX1) 13.34,8.26 20.95,8.26 TEENSY3.1.D4(CANRX) 22.23,10.16 19.3,13.08 U12.4
CANTX
  Top 0.254: TEENSY3.1.D3(CANTX) 18.83,8.67 15.46,8.67 TEENSY3.1.D1(TX1) 14.61,15.81 U12.1
CH_EN:INPUT_POST_DIODE
  Top 0.254: CH_EN:R1.1 112.03,12.7 CH_EN:D1.C
CHARGE_ENABLE
  Top 0.254: CH_EN:D1.A 109.96,12.44 D2.C
  Top 0.508: MAIN.P$2 22.82,53.34 8.89,53.34 7.62,52.07 7.62,8.89 8.89,7.62 103.14,7.62 D2.C
CHARGE_ENABLE_TEENSY  (via drill 0.38)
  Top 0.254: CH_EN:R2.1 CH_EN:R1.2 113.88,8.89 v106.68,8.89 | v50.8,17.78 69.07,17.78 72.39,14.46 72.39,11.43 74.93,8.89 v102.87,8.89
  Bottom 0.254: TEENSY3.1.A4 36.83,17.78 v50.8,17.78 | v106.68,8.89 v102.87,8.89
CS_ADC_5V
  Top 0.254: U11.13 52.03,42.33 51.63,42.74 51.44,42.93 50.8,43.56 U7.8
CS_ADC_TEENSY
  Top 0.254: U11.2 52.03,31.66 34.92,14.55 TEENSY3.1.D9(RX2)
CS_LTC6820  (via drill 0.38)
  Top 0.254: TEENSY3.1.D10(TX2) 37.47,14.61 v36.83,15.24 | U6.5 24.51,57.99 25.07,58.55 v25.26,58.55
  Bottom 0.254: v25.26,58.55 25.41,58.41 25.41,49.12 26.47,48.06 27.36,48.06 27.94,47.48 27.94,39.37 26.67,38.1 26.67,36.83 27.75,35.75 27.75,30.5 28.57,29.68 28.57,23.5 v36.83,15.24
DISCHARGE+
  Top 1.016: $$$$U$3.CONTACT2 126.97,43.33 126.97,64.67 HV+.1 HV+.2
  Bottom 1.016: HV+.2 HV+.1
GND  (via drill 0.35, 0.38, 0.64, 0.76, 1.02)
  Top 0.254: 100A_REF:C1.2 v48.26,68.96 | 100A_REF:U1.3 48.9,78.27 100A_REF:C2.2 49.11,79.84 v49.15,79.88 | 43.75,75.63 v43.81,75.69 | 100A_REF:C3.2 43.75,74.95 43.75,75.63 | 100A_SENSE:C3.2 51.85,61.81 v50.8,62.87 | 100A_SENSE:U1.3 59.05,64.71 58.36,65.41 100A_SENSE:C2.2 54.61,66.25 v54.61,68.33 | 100A_SENSE:C1.2 57.91,56.26 v57.66,56.52 | U$3.P$1 v32,63.5 | v59.18,42.16 61.27,42.16 61.59,42.49 U8.2 | U8.3 60.88,42.67 v60.2,42.67 | v65.53,37.85 64.82,37.85 U9.3 | R23.1 v64.77,33.53 | R22.1 v62.23,33.53 | 16.51,14.95 C15.1 C16.1 16.3,12.11 v15.56,11.37 | U11.7 55.3,36.1 v55.3,34.98 | R15.2 21.17,56.43 v21.21,56.39 | R21.2 v59.69,33.53 | U6.14 23.51,60.59 v23.42,60.5 | R26.2 v47.62,14.35 | v19.05,43.31 19,43.26 R20.2 | C12.2 v47.5,41.27 | R25.2 35.31,28.54 v35.31,28.07 | R24.2 29.34,28.92 v29.34,28.07 | v55.99,38.88 55.99,39.51 56.3,39.82 C13.2 C11.2 55.88,42.97 U7.12 | R1.2 v43.18,81.79 | C6.2 v10.16,68.45 | U6.13 24.01,62.35 23.61,62.76 v22.86,62.76 | U10.3 v25.4,42.16 | R16.1 v60.96,52.2 | BSPD_CURR:R2.2 v21.59,17.02 | CH_EN:R2.2 v114.81,14.61 | IMD_OK:R2.2 27.94,17.65 v27.3,17.02 | SHDN_H:R2.2 v76.71,14.61 | SHDN_I:R2.2 v88.14,14.61 | C10.1 35.52,44.07 v35.56,44.07 | SHDN_J:R2.2 v99.57,14.61 | C1.1 43.75,76.3 43.75,75.63 | U3.2 62.23,70.48 61.85,70.1 v59.31,70.1 C5.1 | U4.2 44.32,68.07 43.69,67.44 42.85,67.44 v42.8,67.49 | R12.2 43.18,61.09 v42.8,60.71 | C9.2 C8.2 33.81,52.77 v33.97,52.77 | v57.15,74.93 C4.1 56.3,72.39 55.12,72.39 54.61,72.9 U2.2 v54.61,74.93 | 12V_IN:R2.2 47.62,61.59 v48.26,62.23 | R18.2 47.84,46.99 v49.28,46.99 50.8,48.51 U7.7 | v16.76,18.16 U12.2
  Top 0.508: v49.28,36.7 49.31,36.66 C14.2
  Top 1.016: D1.A v97.28,31.75
  Route2 6.096: $$$$U$3.COIL+ 102.08,44.37 87.91,30.2
  Bottom 0.254: U14.2 29.34,35.23 v30.23,35.23 | v36.58,35.23 35.69,35.23 U13.2 | R29.2 50.84,38.99 v49.66,38.99 | 60V_TH:R2.2 53.76,55.92 v54.23,56.39
  Bottom 1.016: U5.2 12.91,59.69 | 12.91,59.69 C17.2 | 12.91,59.69 C18.2 | TEENSY3.1.AGND 12.06,25.59 D3.1
  other vias: 12.45,3.94 17.53,3.94 22.61,3.94 27.69,3.94 32.77,3.94 37.85,3.94 42.93,3.94 48.01,3.94 53.09,3.94 58.17,3.94 63.25,3.94 68.33,3.94 73.41,3.94 78.49,3.94 3.94,13.72 3.94,18.8 3.94,23.88 3.94,28.96 3.94,34.04 3.94,39.12 3.94,44.2 3.94,49.28 3.94,54.36 3.94,59.44 3.94,64.52 3.94,69.6 3.94,74.68 3.94,79.76
  pour Top (no thermals): 6.86,87.63 6.86,1.02 1.02,1.02 1.02,87.63
  pour Bottom (no thermals): 6.86,87.63 6.86,1.02 1.02,1.02 1.02,87.63
  pour Top (no thermals): 7.37,6.86 7.37,1.02 86.11,1.02 86.11,6.86
  pour Bottom (no thermals): 7.37,6.86 7.37,1.02 138.98,1.02 138.98,6.86
  pour Route2 (no thermals): 1.02,1.02 132.72,1.02 132.72,87.63 1.02,87.63
HV+FUSED  (via drill 1.02)
  Top 1.016: v99.69,75.44 99.69,72.88 C7.1 | v105.79,77.22 C2.1 108.1,80.16 109.22,81.28 116.84,81.28 118.15,79.97 R3.1 119.42,79.97 124.5,74.89 HV+.8 | HV+.8 HV+.4 HV+.3 HV+.7 HV+.8
  Bottom 1.016: U18.1 111.99,73.89 111.38,73.28 107.31,73.28 105.79,74.8 v105.79,77.22 104.01,75.44 v99.69,75.44 99.47,75.44 96.65,72.62 U15.1 | HV+.8 HV+.7 HV+.3 HV+.4 HV+.8
HV+UNFUSED
  Top 1.016: 84.45,55.24 86.23,57.02 91.95,57.02 95.89,60.96 121.92,60.96 124.5,63.54 HV+.5 HV+.6 | 84.45,55.24 76.68,47.47 $$$$U$3.CONTACT1 | C3.P$1 84.45,55.24
  Bottom 1.016: HV+.6 HV+.5 | C3.P$1 84.45,55.24 76.68,47.47 $$$$U$3.CONTACT1
HV-FUSED  (via drill 1.02)
  Top 1.016: 100.2,64.39 110.11,64.39 | 100.2,64.39 C7.2 100.2,68.45 v99.69,68.96 | C2.2 113.65,74.28 110.11,70.74 110.11,64.39 | INDICATOR.P$2 94.98,64.39 100.2,64.39 | HV-.1 HV-.2 HV-.6 HV-.5 | 110.11,64.39 115.91,64.39 | 115.91,64.39 R11.2 | v119.51,64.39 115.91,64.39
  Bottom 1.016: Q1.3 121.92,61.68 121.92,62.23 | 121.92,62.23 121.91,62.24 121.91,63.29 120.81,64.39 v119.51,64.39 | HV-.5 HV-.1 HV-.2 HV-.6 HV-.5 | HV-.5 122.15,77.53 118.15,81.53 C20.2 110.53,78.26 U18.2@2 U18.2 | HV-.5 121.92,74.95 121.92,62.23 | C19.2 99.69,67.02 v99.69,68.96 98.81,69.85 U15.2 U15.2@2
HV-UNFUSED
  Top 1.016: HV-.8 HV-.7 HV-.3 HV-.4 HV-.8 | HV-.8 123.17,86.36 90.89,86.36 C3.P$2
  Bottom 1.016: HV-.8 HV-.7 HV-.3 HV-.4 HV-.8 | HV-.8 123.17,86.36 90.89,86.36 C3.P$2
IM
  Top 0.254: U1.P$10 11.68,75.86 11.68,64.52 12.06,64.14 24.77,64.14 25.51,63.39 U6.10
IMD_OK  (via drill 0.38, 0.76)
  Top 0.254: v23.5,25.4 23.5,26.04 24.51,27.05 32.13,27.05 33.02,27.94 33.02,31.11 $$U$12.P$1 31.33,34.51 | IMD_OK:D1.A 28.31,14.34 v27.94,13.97
  Top 0.508: v33.02,41.91 33.02,41.06 31.33,39.37 31.33,34.51
  Bottom 0.254: v27.94,13.97 23.5,18.41 v23.5,25.4
  Bottom 0.508: MAIN.P$8 26.8,49.4 30.48,45.72 | v33.02,41.91 33.02,43.18 30.48,45.72 | 30.48,45.72 30.48,43.18 29.21,41.91 U14.3
IMD_OK:INPUT_POST_DIODE
  Top 0.254: IMD_OK:D1.C 29.84,16.77 IMD_OK:R1.1
IMD_OK_12V  (via drill 0.38)
  Top 0.254: IMD.P$5 18.73,40.64 R20.1 | R20.1 19,40.17 18.78,40.39 v20.56,40.39 | v27,34.29 27,32.17 v28.69,30.48 IMD-OK.A | R20.1 19.05,40.32 U$11.P$1
  Bottom 0.254: R28.1 28.69,32.71 v28.69,30.48 | v27,34.29 20.9,40.39 v20.56,40.39
IMD_OK_TEENSY  (via drill 0.38)
  Top 0.254: IMD_OK:R1.2 IMD_OK:R2.1 v27.94,21.59
  Bottom 0.254: v27.94,21.59 27.3,22.23 TEENSY3.1.A5
IP
  Top 0.254: U1.P$12 8.61,66.32 11.43,63.5 24.13,63.5 25.01,62.62 U6.11
ISOSPI-M
  Top 0.508: ISOSPI.P$2 29,80.88 R2.2 28.55,78.93 U1.P$3
ISOSPI-P
  Top 0.508: ISOSPI.P$1 30.7,81.68 R2.1 30.7,78.74 30.7,78.49 27.14,74.93 U1.P$1
MISO_5V
  Top 0.254: U7.10 U11.11
MISO_TEENSY  (via drill 0.38)
  Top 0.254: U11.4 53.34,30.48 v52.07,29.21 42.55,19.68 TEENSY3.1.D12 | R14.2 26.71,59.44 24.06,59.44 23.47,58.85 23.47,57.57 U6.3 23.47,57.51 23.47,57.12 24.2,56.38 28.07,56.38 29.39,55.06 v29.39,53.27
  Bottom 0.254: v52.07,29.21 48.19,33.09 48.19,34.48 v29.39,53.27
MOSI_5V
  Top 0.254: U7.9 52.07,43.18 52.68,42.57 U11.12
MOSI_TEENSY  (via drill 0.38)
  Top 0.254: TEENSY3.1.D11 40.01,18.36 v52.68,31.04 U11.3 | v27.68,55.62 24.34,55.62 23.01,56.96 U6.2
  Bottom 0.254: v52.68,31.04 51.38,31.04 48.83,33.59 48.83,34.86 28.06,55.62 v27.68,55.62
N$2
  cutout Route15 (rank 2): 12.06,64.77 40.64,64.77 40.64,87.63 12.06,87.63
N$3
  Top 0.254: ON-LED.C 44.74,47.32 R18.1
N$4
  Bottom 1.016: Q1.1 118,60.65 113.03,65.62 R30.2
N$5
  Bottom 1.016: U15.3 96.86,68.14 C19.1 93.98,66.04 91.44,68.58 91.44,71.12 93.98,73.66 U17.4
N$7
  Top 1.016: R9.1 118.54,66.25 R11.1
N$8
  Bottom 0.254: U14.1 31.75,34.08 R28.2
N$9
  Top 0.254: R24.1 31.33,30.38 IMD-OK.C
N$10
  Top 1.016: R9.2 116.16,68.03 R8.2
N$11
  Top 0.254: R17.1 R19.1 33.44,44.45 C10.2
N$12
  Top 1.016: R7.1 116.16,69.89 R8.1
N$13
  cutout Route2 (rank 2): 12.06,87.63 40.64,87.63 40.64,64.77 12.06,64.77
N$14
  cutout Route2: 66.04,87.63 66.04,32.38 132.72,32.38 132.72,87.63
  cutout Route15: 66.04,87.63 66.04,32.38 132.72,32.38 132.72,87.63
N$15
  Top 0.254: U4.3 44.97,68.37 45,68.34 45,67.82 43.73,66.55 R10.2 43.73,64.26 R12.1
N$16
  Bottom 0.254: U13.1 38.1,34.08 R27.2
N$17
  Top 0.254: R25.1 37.68,30.38 BMS-OK.C
N$18
  Bottom 1.016: U16.1 71.2,75.06 96.68,75.06 102.95,81.33 108.47,81.33 C20.1 108.68,76.38 U18.3
N$19  (via drill 1.02)
  Top 1.016: R6.1 117.43,71.59 R7.2 113.5,71.59 113.03,71.12 v113.03,69.85
  Bottom 1.016: R30.1 v113.03,69.85
N$20
  Top 1.016: R5.2 116.16,74.72 R6.2
N$21
  Top 1.016: R5.1 116.16,76.42 R4.1
N$22
  Top 1.016: R3.2 116.16,78.27 R4.2
N$23
  Top 0.254: R17.2 31.28,47.37 37.08,47.37 39.75,44.7 40.66,44.7 J1.2
N$29
  Top 0.254: TEENSY.C 46.45,17.36 R26.1
N$30
  Bottom 1.016: U17.2 93,80.76 R31.1
N$31
  Top 0.254: R13.1 21.17,60.4 U6.16
N$32
  Top 0.254: R13.2 R15.1 20.62,59.57 21.82,59.57 22.38,60.13 22.38,60.5 23.01,61.12 U6.15
N$33
  Bottom 1.016: U17.1 70.82,73.66 U16.2
N$34  (via drill 1.02)
  Top 1.016: INDICATOR.P$1 95.89,67.8 v95.89,79.76
  Bottom 1.016: v95.89,79.76 95.58,79.76 94.44,78.61 U17.3
N$35
  Top 0.254: U1.P$11 8.61,76.92 9.96,75.57 10.16,75.36 C6.1
N$58  (via drill 1.02)
  Top 1.016: v107.19,66.8 107.19,70.48 v97.92,79.76
  Bottom 1.016: v107.19,66.8 107.19,64.26 117.3,54.15 Q1.2 | v97.92,79.76 97.92,79.81 95.81,81.92 R31.2
SCK_5V
  Top 0.254: U11.10 53.98,41.91 53.98,42.3 53.98,42.55 54.61,43.18 U7.11
SCK_TEENSY  (via drill 0.35, 0.38)
  Top 0.254: U6.4 24.01,58.47 v24.12,58.58 | TEENSY3.1.D13 42.55,25.65 v50.16,33.27 | U11.5 53.98,34.43 v53.97,34.42
  Bottom 0.254: v24.12,58.58 24.74,59.2 26.14,59.2 27.45,57.9 27.45,57.16 50.16,34.44 | v50.16,33.27 50.16,34.44 | v53.97,34.42 50.19,34.42 50.16,34.44
SHDN_H:INPUT_POST_DIODE
  Top 0.254: SHDN_H:D1.C 75.07,12.57 SHDN_H:R1.1
SHDN_I:INPUT_POST_DIODE
  Top 0.254: SHDN_I:D1.C 86.5,12.57 SHDN_I:R1.1
SHDN_J:INPUT_POST_DIODE
  Top 0.254: SHDN_J:D1.C 97.93,12.57 SHDN_J:R1.1
SHUTDOWN_H  (via drill 0.38)
  Top 0.254: SHDN_H:D1.A 74.67,14.23 v72.39,16.51
  Bottom 0.254: INTERLOCK1.P$1 72.41,19.05 72.39,19.03 v72.39,16.51
  Bottom 1.016: MAIN.P$6 46.99,34.17 46.99,31.75 53.34,25.4 INTERLOCK1.P$1
SHUTDOWN_H_TEENSY  (via drill 0.38)
  Top 0.254: SHDN_H:R1.2 SHDN_H:R2.1 75.14,19.05 v50.8,19.05
  Bottom 0.254: TEENSY3.1.A3 38.1,19.05 v50.8,19.05
SHUTDOWN_I  (via drill 0.38)
  Top 0.254: v85.09,17.78 85.09,16.51 86.36,15.24 SHDN_I:D1.A
  Top 1.016: INTERLOCK2.P$1 INTERLOCK1.P$2
  Bottom 0.254: INTERLOCK2.P$1 85.11,17.8 v85.09,17.78
SHUTDOWN_I_TEENSY  (via drill 0.38)
  Top 0.254: SHDN_I:R1.2 SHDN_I:R2.1 84.03,21.59 v50.8,21.59
  Bottom 0.254: TEENSY3.1.A1 40.64,21.59 v50.8,21.59
SHUTDOWN_J  (via drill 0.38)
  Top 0.254: v97.79,17.78 SHDN_J:D1.A
  Top 0.508: D2.A 99.33,22.86 97.79,22.86 95.25,25.4
  Top 1.016: INTERLOCK2.P$2 95.25,25.4 RELAY.P$1 102.08,29.67 102.08,31.75 | $$$$U$3.COIL- 102.08,31.75 | D1.C 102.08,31.75
  Bottom 0.254: RELAY.P$1 97.81,17.8 v97.79,17.78
SHUTDOWN_J_TEENSY  (via drill 0.38)
  Top 0.254: SHDN_J:R1.2 SHDN_J:R2.1 94.19,22.86 v50.8,22.86
  Bottom 0.254: TEENSY3.1.A0 41.91,22.86 v50.8,22.86
TEENSY_STATUS
  Top 0.254: TEENSY3.1.D6 28.19,10.41 32.83,10.41 34.57,8.67 42.9,8.67 44.45,10.22 44.45,12.06 46.35,13.97 TEENSY.A
WATCHDOG_INPUT  (via drill 0.38)
  Top 0.254: v60.33,37.72 59.69,37.08 R21.1 58,36.41 57.15,35.56 57.15,33.02 48.83,24.7 48.83,10.73 46.23,8.13 31.24,8.13 TEENSY3.1.D7(RX3) | U8.4 60.96,40.39 v60.33,39.75
  Bottom 0.254: v60.33,37.72 v60.33,39.75
WATCHDOG_OK
  Top 0.254: U9.2 64.14,40.62 62.26,42.49 U8.1 62.26,43.18 60.96,44.48 60.96,45.72 60.96,46.35 | U$9.P$1 60.96,46.35 | R16.2 60.96,46.35

### Text on the board
tDocu: TS | isoSPI | GLV | TS | DANGER / HIGH VOLTAGE | isoSPI | GLV | isoSPI | GLV | GND | DANGER / HIGH VOLTAGE | +5V | CURRENT | TS | +12V | BSPD | GLV | +3.3V | THRESHOLD | WATCHDOG | BMS STATUS | IMD STATUS | TS | TS | GLV | GLV | HyTech Racing 2021 / HV Board rev14 / Designed by Cody Kaminsky, / based on rev13 by Arvind Srinivasan
bDocu: GLV | isoSPI | GLV | TS | DANGER / HIGH VOLTAGE | isoSPI | GLV | isoSPI | GLV | DANGER / HIGH VOLTAGE | TS | GLV | TS | TS | GLV | GLV